# EasyEDA Pro project CyclingAssistance.eprj

# Schematic Schematic1_1
Create Date: 2024-09-04; Page Name: P1; Project Name: CyclingAssistance; Schematic Name: Schematic1_1; Update Date: 2024-09-07; Company: 嘉立创EDA; Page Size: A3; Version: V1.1
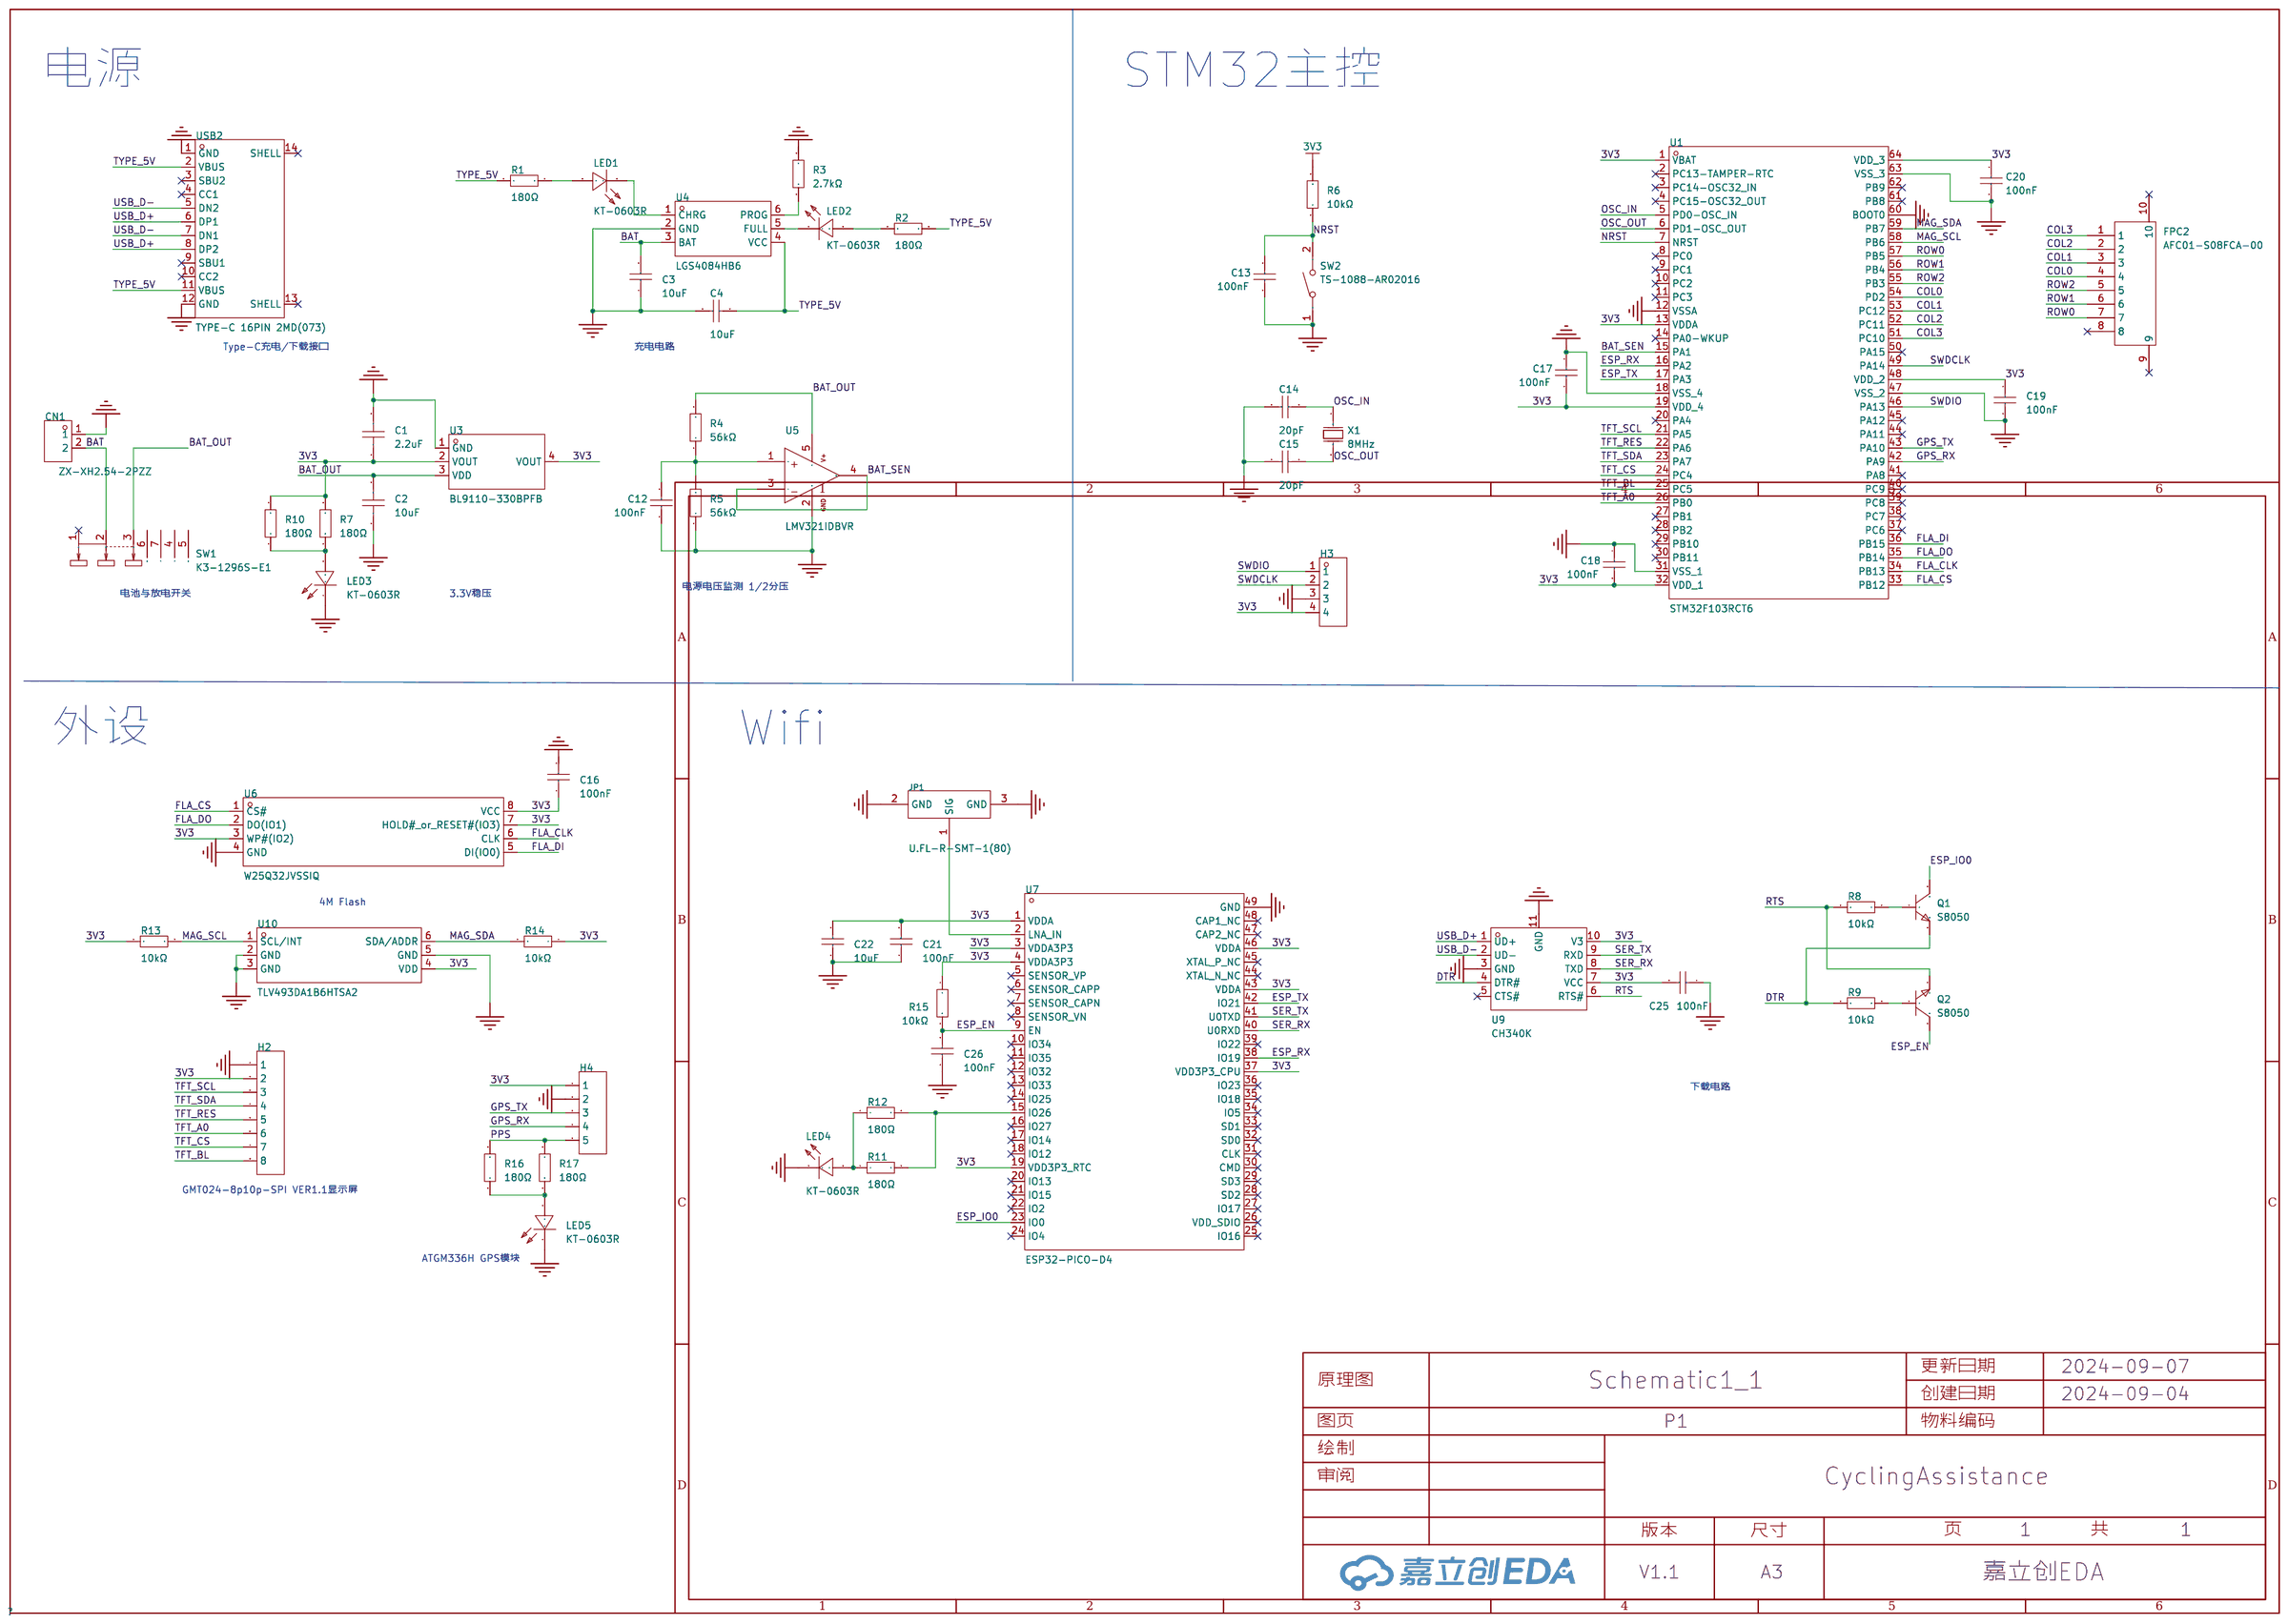
[diagram p0: schematic sheet]

## Parts
C1  2.2uF  [C0402]
C2  10uF  [C0402]
C3  10uF  [C0402]
C4  10uF  [C0402]
C12  100nF  [C0402]
C13  100nF  [C0402]
C14  20pF  [C0402]
C15  20pF  [C0402]
C16  100nF  [C0402]
C17  100nF  [C0402]
C18  100nF  [C0402]
C19  100nF  [C0402]
C20  100nF  [C0402]
C21  100nF  [C0402]
C22  10uF  [C0402]
C25  100nF  [C0402]
C26  100nF  [C0402]
CN1  ZX-XH2.54-2PZZ  [CONN-TH_2P-P2.50_HX25003-2A]
FPC2  AFC01-S08FCA-00  [FPC-SMD_P0.50-8P_FGS-XJ-H2.0]
H2  -  [HDR-TH_8P-P2.54-V-F-1]
H3  -  [HDR-TH_4P-P2.54-V-M]
H4  -  [HDR-TH_5P-P2.54-V-F]
JP1  U.FL-R-SMT-1(80)  [RF-SMD_FRF05002-JSS103M]
LED1  KT-0603R  [LED0603-RD]
LED2  KT-0603R  [LED0603-RD]
LED3  KT-0603R  [LED0603-RD]
LED4  KT-0603R  [LED0603-RD]
LED5  KT-0603R  [LED0603-RD]
Q1  S8050  [SOT-23-3_L2.9-W1.6-P1.90-LS2.8-BR]
Q2  S8050  [SOT-23-3_L2.9-W1.6-P1.90-LS2.8-BR]
R1  180Ω  [R0402]
R2  180Ω  [R0402]
R3  2.7kΩ  [R0402]
R4  56kΩ  [R0402]
R5  56kΩ  [R0402]
R6  10kΩ  [R0603]
R7  180Ω  [R0402]
R8  10kΩ  [R0603]
R9  10kΩ  [R0603]
R10  180Ω  [R0402]
R11  180Ω  [R0402]
R12  180Ω  [R0402]
R13  10kΩ  [R0603]
R14  10kΩ  [R0603]
R15  10kΩ  [R0603]
R16  180Ω  [R0402]
R17  180Ω  [R0402]
SW1  K3-1296S-E1  [SW-TH_K3-1296S-E1]
SW2  TS-1088-AR02016  [SW-SMD_L3.9-W3.0-P4.45]
U1  STM32F103RCT6  [LQFP-64_L10.0-W10.0-P0.50-LS12.0-BL]
U3  BL9110-330BPFB  [SOT-223_L6.5-W3.5-P2.30-LS7.0-BR]
U4  LGS4084HB6  [SOT-23-6_L2.9-W1.6-P0.95-LS2.8-BL]
U5  LMV321IDBVR  [SOT-23-5_L3.0-W1.7-P0.95-LS2.8-BR]
U6  W25Q32JVSSIQ  [SOIC-8_L5.3-W5.3-P1.27-LS8.0-BL]
U7  ESP32-PICO-D4  [ESP32-PICO-D4_lengthen]
U9  CH340K  [ESOP-10_L4.9-W3.9-P1.00-LS6.0-BL-EP]
U10  TLV493DA1B6HTSA2  [SOP-6_L3.0-W1.5-P0.95-LS2.5-BR]
USB2  TYPE-C 16PIN 2MD(073)  [USB-C-SMD_TYPE-C-6PIN-2MD-073]
X1  8MHz  [CRYSTAL-SMD_L11.5-W4.8-LS12.7]

## Library data of the parts
C1 = HGC0402R5225K160NTEJ: 容值:2.2uF;精度:±10%;额定电压:16V;材质(温度系数):X5R;; LCSC Part Name: 2.2uF ±10% 16V; Supplier Part: C7432763; Manufacturer: Chinocera(华瓷); Supplier Footprint: 0402; JLCPCB Part Class: Extended Part; Datasheet: https://atta.szlcsc.com/upload/public/pdf/source/20240320/FAC3FEC40A78BC5CCCE96C232A94D860.pdf; Supplier: LCSC; Tolerance: ±10%; Voltage Rated: 16V; Temperature Coefficient: X5R
C2 = CGA0402X5R106M100GT: 容值:10uF;精度:±20%;额定电压:10V;材质(温度系数):X5R;; LCSC Part Name: 10uF ±20% 10V; Supplier Part: C6119763; Manufacturer: HRE(芯声); Supplier Footprint: 0402; JLCPCB Part Class: Extended Part; Supplier: LCSC; Tolerance: ±20%; Voltage Rated: 10V; Temperature Coefficient: X5R
C3 C4 C22 = CL05A106MQ5NUNC: 容值:10uF;精度:±20%;额定电压:6.3V;材质(温度系数):X5R;; LCSC Part Name: 10uF ±20% 6.3V; Supplier Part: C15525; Manufacturer: SAMSUNG(三星); Supplier Footprint: 0402; JLCPCB Part Class: Basic Part; Datasheet: https://atta.szlcsc.com/upload/public/pdf/source/20220823/2B02EE04F8F211D38A52DCB16EB6BEBA.pdf; Supplier: LCSC; Tolerance: ±20%; Voltage Rated: 6.3V; Temperature Coefficient: X5R
C12 C13 C16-C21 C25 C26 = CL05B104KO5NNNC: 容值:100nF;精度:±10%;额定电压:16V;材质(温度系数):X7R;; LCSC Part Name: 100nF ±10% 16V; Supplier Part: C1525; Manufacturer: SAMSUNG(三星); Supplier Footprint: 0402; JLCPCB Part Class: Basic Part; Datasheet: https://atta.szlcsc.com/upload/public/pdf/source/20160218/1457707763339.pdf; Supplier: LCSC; Tolerance: ±10%; Voltage Rated: 16V; Temperature Coefficient: X7R
C14 C15 = 0402CG200J500NT: 容值:20pF;精度:±5%;额定电压:50V;材质(温度系数):C0G;; LCSC Part Name: 20pF ±5% 50V; Supplier Part: C1554; Manufacturer: FH(风华); Supplier Footprint: 0402; JLCPCB Part Class: Basic Part; Datasheet: https://atta.szlcsc.com/upload/public/pdf/source/20200305/C486355_26A10D38EF8C2A5C37091D0039909270.pdf; Supplier: LCSC; Tolerance: ±5%; Voltage Rated: 50V; Temperature Coefficient: C0G
CN1 = ZX-XH2.54-2PZZ: 插针结构:1x2P;间距:2.54mm;安装方式:直插;参考系列:XH;总PIN数:2P;排数:1;每排PIN数:2;行距:-;额定电流:3A;触头材质:黄铜;触头镀层:锡;工作温度范围:-25℃~+85℃;; Supplier Part: C7429632; Manufacturer: Megastar(兆星); Supplier Footprint: 插件,P=2.54mm; JLCPCB Part Class: Extended Part; Datasheet: https://atta.szlcsc.com/upload/public/pdf/source/20230619/19BA6947230AA44A04D3EDD65E618FD0.pdf; Supplier: LCSC; Pins Structure: 1x2P; Pitch: 2.54mm; Mounting Style: 直插; Reference Series: XH; Number of Pins: 2P; Number of Rows: 1; Number of PINs Per Row: 2; Current Rating (Max): 3A; Contact Material: 黄铜; Contact Plating: 锡; Operating Temperature Range: -25℃~+85℃
FPC2 = AFC01-S08FCA-00: 锁定特性:翻盖式;触点类型:下接;触点数量:8P;间距:0.5mm;安装类型:卧贴;; LCSC Part Name: 间距:0.5mm P数:8P 翻盖式 下接; Supplier Part: C262657; Manufacturer: JS(钜硕电子); Supplier Footprint: SMD,P=0.5mm,卧贴; JLCPCB Part Class: Extended Part; Datasheet: https://atta.szlcsc.com/upload/public/pdf/source/20190816/C413942_2A72D1AC756EAE17EEDF756A339D4500.pdf; Supplier: LCSC; Locking Feature: 翻盖式; Contact Type: 下接; Number of Contacts: 8P; Pitch: 0.5mm; Mounting Type: 卧贴; FFC, FCB Thickness: 0.3mm; Height Above Board: 2mm
H2 = HDR-F_2.54_1x8P: Supplier Part: C27438; Supplier Footprint: 插件
H3 = HDR-M_2.54_1x4P: Supplier Part: C492403; Supplier Footprint: 插件
H4 = HDR-F_2.54_1x5P: Supplier Part: C50950; Supplier Footprint: 插件
JP1 = U.FL-R-SMT-1(80)_C88374: 连接器类型:板端;接口类型:内针;端口数量:1;接口直径:2mm;接口长度/高度:1.25mm;频率-最大值:6GHz;射频系列:IPEX;阻抗:50Ω;样式:-;触头材质:黄铜;工作温度范围:-40℃~+90℃;; LCSC Part Name: IPEX 内针; Supplier Part: C88374; Manufacturer: HRS(广濑); Supplier Footprint: SMD; JLCPCB Part Class: Extended Part; Datasheet: https://atta.szlcsc.com/upload/public/pdf/source/20161125/1480067868647.pdf; Supplier: LCSC; Connector Type: 板端; Interface Type: 内针; Number of Ports: 1; Interface Diameter: 2mm; Interface Length/Height: 1.25mm; Frequency-Max: 6GHz; RF Series: IPEX; Impedance: 50Ω; Contact Material: 黄铜; Operating Temperature Range: -40℃~+90℃
LED1-LED5 = KT-0603R: 发光颜色:红色;功率:-;正向电流:-;主波长:-;二极管配置:-;透镜颜色:-;色温:-;发光角度:-;载带方式:-;工作温度:-40℃~+85℃;; LCSC Part Name: 0603 红灯 高亮; Supplier Part: C2286; Manufacturer: KENTO; Supplier Footprint: 0603; JLCPCB Part Class: Basic Part; Datasheet: https://atta.szlcsc.com/upload/public/pdf/source/20160616/1466072038404.pdf; Supplier: LCSC; Emitted Color: 红色; Operating Temperature: -40℃~+85℃
Q1 Q2 = S8050_C181158: 晶体管类型:NPN;集电极电流(Ic):500mA;集射极击穿电压(Vceo):25V;功率(Pd):300mW;; LCSC Part Name: NPN 电流:500mA 耐压:25V; Supplier Part: C181158; Manufacturer: Hottech(合科泰); Supplier Footprint: SOT-23; JLCPCB Part Class: Extended Part; Datasheet: https://atta.szlcsc.com/upload/public/pdf/source/20220506/D987F39D56F2975D34EC7947E75C4ABC.pdf; Supplier: LCSC; Transistor Type: NPN; Collector Current (Ic): 500mA; Collector-Emitter Breakdown Voltage (Vceo): 25V; Power Dissipation (Pd): 300mW; Transition Frequency (fT): 150MHz; Collector Cut-Off Current (Icbo): 100nA; Collector-Emitter Saturation Voltage (VCE(sat)@Ic,Ib): 600mV@500mA,50mA
R1 R2 R7 R10-R12 R16 R17 = 0402WGF1800TCE: 电阻类型:厚膜电阻;阻值:180Ω;精度:±1%;功率:62.5mW;最大工作电压:50V;温度系数:±100ppm/℃;; LCSC Part Name: 180Ω ±1% 62.5mW 厚膜电阻; Supplier Part: C38941; Manufacturer: UNI-ROYAL(厚声); Supplier Footprint: 0402; JLCPCB Part Class: Extended Part; Datasheet: https://atta.szlcsc.com/upload/public/pdf/source/20200306/C422600_1E6D84923E4A46A82E41ADD87F860B5C.pdf; Supplier: LCSC; Type: 厚膜电阻; Tolerance: ±1%; Power(Watts): 62.5mW; Overload Voltage (Max): 50V; Temperature Coefficient: ±100ppm/℃; Operating Temperature Range: -55℃~+155℃
R3 = 0402WGF2701TCE: 电阻类型:厚膜电阻;阻值:2.7kΩ;精度:±1%;功率:62.5mW;最大工作电压:50V;温度系数:±100ppm/℃;; LCSC Part Name: 2.7kΩ ±1% 62.5mW 厚膜电阻; Supplier Part: C25885; Manufacturer: UNI-ROYAL(厚声); Supplier Footprint: 0402; JLCPCB Part Class: Extended Part; Datasheet: https://atta.szlcsc.com/upload/public/pdf/source/20200306/C422600_1E6D84923E4A46A82E41ADD87F860B5C.pdf; Supplier: LCSC; Type: 厚膜电阻; Tolerance: ±1%; Power(Watts): 62.5mW; Overload Voltage (Max): 50V; Temperature Coefficient: ±100ppm/℃; Operating Temperature Range: -55℃~+155℃
R4 R5 = RC0402FR-0756KL: 电阻类型:厚膜电阻;阻值:56kΩ;精度:±1%;功率:62.5mW;最大工作电压:50V;温度系数:±100ppm/℃;; LCSC Part Name: 厚膜电阻 56kΩ ±1% 62.5mW; Supplier Part: C114756; Manufacturer: YAGEO(国巨); Supplier Footprint: 0402; JLCPCB Part Class: Extended Part; Datasheet: https://atta.szlcsc.com/upload/public/pdf/source/20180821/C275644_0D56F95EFF785E7D9A1FEF436B37DA78.pdf; Supplier: LCSC; Type: 厚膜电阻; Tolerance: ±1%; Power(Watts): 62.5mW; Overload Voltage (Max): 50V; Temperature Coefficient: ±100ppm/℃; Operating Temperature Range: -55℃~+155℃
R6 R8 R9 R13-R15 = 0603WAF1002T5E: 电阻类型:厚膜电阻;阻值:10kΩ;精度:±1%;功率:100mW;最大工作电压:75V;温度系数:±100ppm/℃;; LCSC Part Name: 厚膜电阻 10kΩ ±1% 100mW; Supplier Part: C25804; Manufacturer: UNI-ROYAL(厚声); Supplier Footprint: 0603; JLCPCB Part Class: Basic Part; Datasheet: https://atta.szlcsc.com/upload/public/pdf/source/20200306/C422600_1E6D84923E4A46A82E41ADD87F860B5C.pdf; Supplier: LCSC; Type: 厚膜电阻; Tolerance: ±1%; Power(Watts): 100mW; Overload Voltage (Max): 75V; Temperature Coefficient: ±100ppm/℃; Operating Temperature Range: -55℃~+155℃
SW1 = K3-1296S-E1: 电路结构:单刀双掷;安装方式:卧贴;开关颜色:黑色;额定电流(DC):300mA;额定电压(DC):4V;额定电流(AC):-;额定电压(AC):-;机械寿命:1万次;; LCSC Part Name: 卧贴双档 滑动开关; Supplier Part: C128955; Manufacturer: 韩国韩荣; Supplier Footprint: SMD; JLCPCB Part Class: Extended Part; Datasheet: https://atta.szlcsc.com/upload/public/pdf/source/20210810/891A308926761427C641228111E8C4D0.pdf; Supplier: LCSC; Circuit: 单刀双掷; Actuator Style: 矩形柱状; Pin Style: SMD接片; Switch Length: 6.6mm; Switch Width: 2.7mm; Switch Height: 1.4mm; Mounting Style: 卧贴; Actuator Color: 黑色; Current Rating (DC): 300mA; Voltage Rating (DC): 4V; Mechanical Life: 1万次; Operating Temperature: -25℃~+80℃
SW2 = TS-1088-AR02016: 电路结构:单刀单掷;按钮形状:圆形按钮;作用力:160gf;安装方式:立贴;开关长度:4mm;开关宽度:3mm;开关高度:2mm;带支架:不带;触点电流:50mA;额定电压(DC):12V;绝缘电阻:100MΩ;机械寿命:10万次;; LCSC Part Name: 4*3*2mm 立贴 轻触开关; Supplier Part: C720477; Manufacturer: XUNPU(讯普); Supplier Footprint: SMD; JLCPCB Part Class: Extended Part; Datasheet: https://atta.szlcsc.com/upload/public/pdf/source/20200810/C720475_60D09DD6C54279ADDB2DC25100F1CC11.pdf; Supplier: LCSC; Circuit: 单刀单掷; Actuator Style: 圆形按钮; Operating Force: 160gf; Mounting Style: 立贴; Switch Length: 4mm; Switch Width: 3mm; Switch Height: 2mm; Strike Gundam: 不带; Contact Current: 50mA; Voltage Rating (DC): 12V; Insulation Resistance: 100MΩ; Actuator/Cap Color: 黑色; Pin Style: SMD接片; Mechanical Life: 10万次; Operating Temperature: -30℃~+80℃
U1 = STM32F103RCT6: CPU内核:ARM-M3;程序存储容量:256KB;RAM总容量:48KB;GPIO端口数量:51;工作电压范围:2V~3.6V;CPU最大主频:72MHz;程序存储器类型:FLASH;; LCSC Part Name: 主流增强型ARM Cortex-M3 MCU，具有256 KB Flash、72 MHz CPU、电机控制、USB和CAN; Supplier Part: C8323; Manufacturer: ST(意法半导体); Supplier Footprint: LQFP-64(10x10); JLCPCB Part Class: Extended Part; Datasheet: https://atta.szlcsc.com/upload/public/pdf/source/20180207/C88442_15179953708671359491.pdf; Supplier: LCSC; CPU Core: ARM-M3; Program Storage Size: 256KB; RAM Size: 48KB; GPIO Ports Number: 51; Operating Voltage Range: 2V~3.6V; CPU Maximum Speed: 72MHz; Program Memory Type: FLASH; Operating Temperature Range: -40℃~+85℃; ADC (Bit): 12bit; DAC (Bit): 12bit; Universal Serial Bus: 有; Peripheral/Function: DMA；温度传感器；PWM; Watchdog: 有; Infrared Data Association: 有; Low-Voltage Detect: 有; Direct Memory Access: 有; Internal Oscillator: 有
U3 = BL9110-330BPFB: 输出类型:固定;最大输入电压:6V;输出电压:3.3V;最大输出电流:1A;电源纹波抑制比(PSRR):70dB@(1kHz);输出极性:正极;; LCSC Part Name: 输入6V 输出3.3V 1A; Supplier Part: C169246; Manufacturer: BL(上海贝岭); Supplier Footprint: SOT-223; JLCPCB Part Class: Extended Part; Datasheet: https://atta.szlcsc.com/upload/public/pdf/source/20180705/C248270_2CFF879E361E2024221F82A6F237DEBB.pdf; Supplier: LCSC; Output Type: 固定; Maximum Input Voltage: 6V; Output Voltage: 3.3V; MAX Output Current: 1A; Power Supply Rejection Ratio (PSRR): 70dB@(1kHz); Dropout Voltage: 390mV@(1A); Output Polarity: 正极; Number of Outputs: 1
U4 = LGS4084HB6: 电源电压:4V~6V;最大充电电流:500mA;电池类型:锂离子/聚合物;电池节数:1;; LCSC Part Name: 单节锂电池充电 高压4054(SOT23-6); Supplier Part: C5299901; Manufacturer: Legend-Si(棱晶半导体); Supplier Footprint: SOT-23-6; JLCPCB Part Class: Extended Part; Datasheet: https://atta.szlcsc.com/upload/public/pdf/source/20230407/94D9C0552C6EF587CC76B9FFE17BDA56.pdf; Supplier: LCSC; The Chip Type: 线性充电芯片; Supply Voltage: 4V~6V; Maximum Charge Current: 500mA; Charging Saturation Voltage: 4.2V; Type of Battery: 锂离子/聚合物; Number of Cells: 1; Operating Temperature: -40℃~+125℃
U5 = LMV321IDBVR_C7972: 放大器数:单路;增益带宽积(GBP):1MHz;输入偏置电流(Ib):15nA;压摆率(SR):1V/us;带宽(-3db):-;轨到轨:-;; Supplier Part: C7972; Manufacturer: TI(德州仪器); Supplier Footprint: SOT-23-5; JLCPCB Part Class: Extended Part; Datasheet: https://www.ti.com/cn/lit/gpn/lmv321; Supplier: LCSC; Number of Circuits: 单路; Gain Bandwidth Product(GBP): 1MHz; Current - Input Bias(Ib): 15nA; Slew Rate(SR): 1V/us; Output Current: 160mA; Supply Current: 130uA; Operating Temperature: -40℃~+125℃
U6 = W25Q32JVSSIQ: Supplier Part: C179173; Manufacturer: WINBOND(华邦); Supplier Footprint: SOIC-8-208mil; JLCPCB Part Class: Extended Part; Datasheet: https://atta.szlcsc.com/upload/public/pdf/source/20191218/C179173_5BBD793D2D7B3672E140BC7AE85C11FF.pdf; Supplier: LCSC
U7 = ESP32-PICO-D4: 频率范围:2.4GHz~2.5GHz;接口:ADC, SDIO, SPI, PWM, UART, I2C, I2S, GPIO;应用领域:蓝牙,WiFi;数据速率:-;灵敏度:-;典型应用频率:-;; LCSC Part Name: 集成2.4GHz WIFI和蓝牙的模组; Supplier Part: C193707; Manufacturer: ESPRESSIF(乐鑫); Supplier Footprint: QFN-48-EP(7x7); JLCPCB Part Class: Extended Part; Datasheet: https://atta.szlcsc.com/upload/public/pdf/source/20180531/C193707_20E6BADDB6EC95F0C0D505BA515D2866.pdf; Supplier: LCSC; Frequency Range: 2.4GHz~2.5GHz; Interface: ADC, SDIO, SPI, PWM, UART, I2C, I2S, GPIO; Operating Voltage: 2.7V~3.6V; Applications: 蓝牙,WiFi; Operating Temperature: -40℃~+85℃
U9 = CH340K_C18208922: LCSC Part Name: CH340K 人工转编带; Supplier Part: C18208922; Manufacturer: WCH(南京沁恒); Supplier Footprint: ESSOP-10-150mil-1mm; JLCPCB Part Class: Extended Part; Datasheet: https://atta.szlcsc.com/upload/public/pdf/source/20240313/9D833A30DDFD16C064A7ADE10A944019.pdf; Supplier: LCSC
U10 = TLV493DA1B6HTSA2: 3D磁性传感器; LCSC Part Name: 磁场传感器; Supplier Part: C126688; Manufacturer: Infineon(英飞凌); Supplier Footprint: SOP-6-1.5mm; JLCPCB Part Class: Extended Part; Datasheet: https://atta.szlcsc.com/upload/public/pdf/source/20170818/C126688_1503051290851895354.pdf; Supplier: LCSC
USB2 = TYPE-C 16PIN 2MD(073): 连接器类型:Type-C;标准:-;公母:母;端口数量:1;触点数量:16P;安装方式:卧贴;额定电流 - 电源:5A;工作温度范围:-25℃~+85℃;; LCSC Part Name: Type-C 母 卧贴; Supplier Part: C2765186; Manufacturer: SHOU HAN(首韩); Supplier Footprint: SMD; JLCPCB Part Class: Extended Part; Datasheet: https://atta.szlcsc.com/upload/public/pdf/source/20211123/39B17C16241EAC15C5E277BDA434118E.pdf; Supplier: LCSC; Connector Type: Type-C; Gender: 母; Number of Ports: 1; Number of Contacts: 16P; Mounting Style: 卧贴; Current Rating - Power (Max): 5A; Operating Temperature Range: -25℃~+85℃
X1 = X49SM8MSD2SC: 晶振类型:贴片晶振;频率:8MHz;常温频差:±20ppm;外接负载电容:20pF;频率稳定度(全温):±30ppm;; LCSC Part Name: 8MHz ±20ppm 20pF; Supplier Part: C12674; Manufacturer: YXC(扬兴晶振); Supplier Footprint: HC-49S-SMD; JLCPCB Part Class: Basic Part; Datasheet: https://atta.szlcsc.com/upload/public/pdf/source/20240329/3EBF42EBCAB50CA65B6FA9D7CFA1955A.pdf; Supplier: LCSC; Crystal Type: 贴片晶振; Normal temperature Frequency Tolerance: ±20ppm; External load capacitor: 20pF; Frequency Stability(Full temperature range): ±30ppm; Operating Temperature: -20℃~+70℃

## Nets
3V3: C1.1 C16.1 C17.2 C18.2 C19.1 C20.1 C21.2 C22.2 C25.2 H2.2 H3.4 H4.1 R6.2 R7.2 R10.2 R13.1 R14.1 R15.1 U1.1(VBAT) U1.13(VDDA) U1.19(VDD_4) U1.32(VDD_1) U1.48(VDD_2) U1.64(VDD_3) U3.2(VOUT) U3.4(VOUT) U6.3(WP#(IO2)) U6.7(HOLD# or RESET#(IO3)) U6.8(VCC) U7.1(VDDA) U7.3(VDDA3P3) U7.4(VDDA3P3) U7.19(VDD3P3_RTC) U7.37(VDD3P3_CPU) U7.43(VDDA) U7.46(VDDA) U9.7(VCC) U9.10(V3) U10.4(VDD)
GND: C1.2 C2.1 C3.1 C4.1 C12.2 C13.2 C14.1 C15.1 C16.2 C17.1 C18.1 C19.2 C20.2 C21.1 C22.1 C25.1 C26.1 CN1.1 H2.1 H3.3 H4.2 JP1.2(GND) JP1.3(GND) LED3.1(K) LED4.1(K) LED5.1(K) R3.2 R5.1 SW2.1 U1.12(VSSA) U1.18(VSS_4) U1.31(VSS_1) U1.47(VSS_2) U1.60(BOOT0) U1.63(VSS_3) U3.1(GND) U4.2(GND) U5.2(GND) U6.4(GND) U7.49(GND) U9.3(GND) U9.11(GND) U10.2(GND) U10.3(GND) U10.5(GND) USB2.1(GND) USB2.12(GND)
BAT: C3.2 CN1.2 SW1.2 U4.3(BAT)
BAT_OUT: C2.2 R4.2 SW1.3 U3.3(VDD) U5.5(V+)
BAT_SEN: U1.15(PA1) U5.3(-) U5.4(OUT)
COL0: FPC2.4 U1.54(PD2)
COL1: FPC2.3 U1.53(PC12)
COL2: FPC2.2 U1.52(PC11)
COL3: FPC2.1 U1.51(PC10)
DTR: Q1.2 R9.1 U9.4(DTR#)
ESP_EN: C26.2 Q2.3 R15.2 U7.9(EN)
ESP_IO0: Q1.3 U7.23(IO0)
ESP_RX: U1.16(PA2) U7.38(IO19)
ESP_TX: U1.17(PA3) U7.42(IO21)
FLA_CLK: U1.34(PB13) U6.6(CLK)
FLA_CS: U1.33(PB12) U6.1(CS#)
FLA_DI: U1.36(PB15) U6.5(DI(IO0))
FLA_DO: U1.35(PB14) U6.2(DO(IO1))
GPS_RX: H4.4 U1.42(PA9)
GPS_TX: H4.3 U1.43(PA10)
MAG_SCL: R13.2 U1.58(PB6) U10.1(SCL/INT)
MAG_SDA: R14.2 U1.59(PB7) U10.6(SDA/ADDR)
NRST: C13.1 R6.1 SW2.2 U1.7(NRST)
OSC_IN: C14.2 U1.5(PD0-OSC_IN) X1.1(OSC1)
OSC_OUT: C15.2 U1.6(PD1-OSC_OUT) X1.2(OSC2)
PPS: H4.5 R16.2 R17.2
ROW0: FPC2.7 U1.57(PB5)
ROW1: FPC2.6 U1.56(PB4)
ROW2: FPC2.5 U1.55(PB3)
RTS: Q2.2 R8.2 U9.6(RTS#)
SER_RX: U7.40(U0RXD) U9.8(TXD)
SER_TX: U7.41(U0TXD) U9.9(RXD)
SWDCLK: H3.2 U1.49(PA14)
SWDIO: H3.1 U1.46(PA13)
TFT_A0: H2.6 U1.26(PB0)
TFT_BL: H2.8 U1.25(PC5)
TFT_CS: H2.7 U1.24(PC4)
TFT_RES: H2.5 U1.22(PA6)
TFT_SCL: H2.3 U1.21(PA5)
TFT_SDA: H2.4 U1.23(PA7)
TYPE_5V: C4.2 R1.1 R2.2 U4.4(VCC) USB2.2(VBUS) USB2.11(VBUS)
USB_D+: U9.1(UD+) USB2.6(DP1) USB2.8(DP2)
USB_D-: U9.2(UD-) USB2.5(DN2) USB2.7(DN1)
$1N1886: R3.1 U4.6(PROG)
$1N2415: C12.1 R4.1 R5.2 U5.1(+)
$1N24529: JP1.1(SIG) U7.2(LNA_IN)
$1N36211: R11.2 R12.2 U7.15(IO26)
$1N38447: Q2.1 R9.2
$1N38448: Q1.1 R8.1
Net-(LED1-1): LED1.1(K) U4.1(CHRG)
Net-(LED1-2): LED1.2(A) R1.2
Net-(LED2-1): LED2.1(K) U4.5(FULL)
Net-(LED2-2): LED2.2(A) R2.1
Net-(LED3-2): LED3.2(A) R7.1 R10.1
Net-(LED4-2): LED4.2(A) R11.1 R12.1
Net-(LED5-2): LED5.2(A) R16.1 R17.1

Not connected (* = marked no-connect by the designer): FPC2 8* 9* 10*; SW1 1* 4 5 6 7; U1 2(PC13-TAMPER-RTC)* 3(PC14-OSC32_IN)* 4(PC15-OSC32_OUT)* 8(PC0)* 9(PC1)* 10(PC2)* 11(PC3)* 14(PA0-WKUP)* 20(PA4)* 27(PB1)* 28(PB2)* 29(PB10)* 30(PB11)* 37(PC6)* 38(PC7)* 39(PC8)* 40(PC9)* 41(PA8)* 44(PA11)* 45(PA12)* 50(PA15)* 61(PB8)* 62(PB9)*; U7 5(SENSOR_VP)* 6(SENSOR_CAPP)* 7(SENSOR_CAPN)* 8(SENSOR_VN)* 10(IO34)* 11(IO35)* 12(IO32)* 13(IO33)* 14(IO25)* 16(IO27)* 17(IO14)* 18(IO12)* 20(IO13)* 21(IO15)* 22(IO2)* 24(IO4)* 25(IO16)* 26(VDD_SDIO)* 27(IO17)* 28(SD2)* 29(SD3)* 30(CMD)* 31(CLK)* 32(SD0)* 33(SD1)* 34(IO5)* 35(IO18)* 36(IO23)* 39(IO22)* 44(XTAL_N_NC)* 45(XTAL_P_NC)* 47(CAP2_NC)* 48(CAP1_NC)*; U9 5(CTS#)*; USB2 3(SBU2)* 4(CC1)* 9(SBU1)* 10(CC2)* 13(SHELL)* 14(SHELL)*

## Notes on the sheet
- 电源
- STM32主控
- Type-C充电/下载接口
- 充电电路
- 电池与放电开关
- 3.3V稳压
- 电源电压监测 1/2分压
- 外设
- Wifi
- 4M Flash
- 下载电路
- GMT024-8p10p-SPI VER1.1显示屏
- ATGM336H GPS模块

# Schematic Schematic2
Create Date: 2024-09-06; Page Name: P1; Project Name: CyclingAssistance; Schematic Name: Schematic2; Update Date: 2024-09-06; Company: 嘉立创EDA; Page Size: A4; Version: V1.0
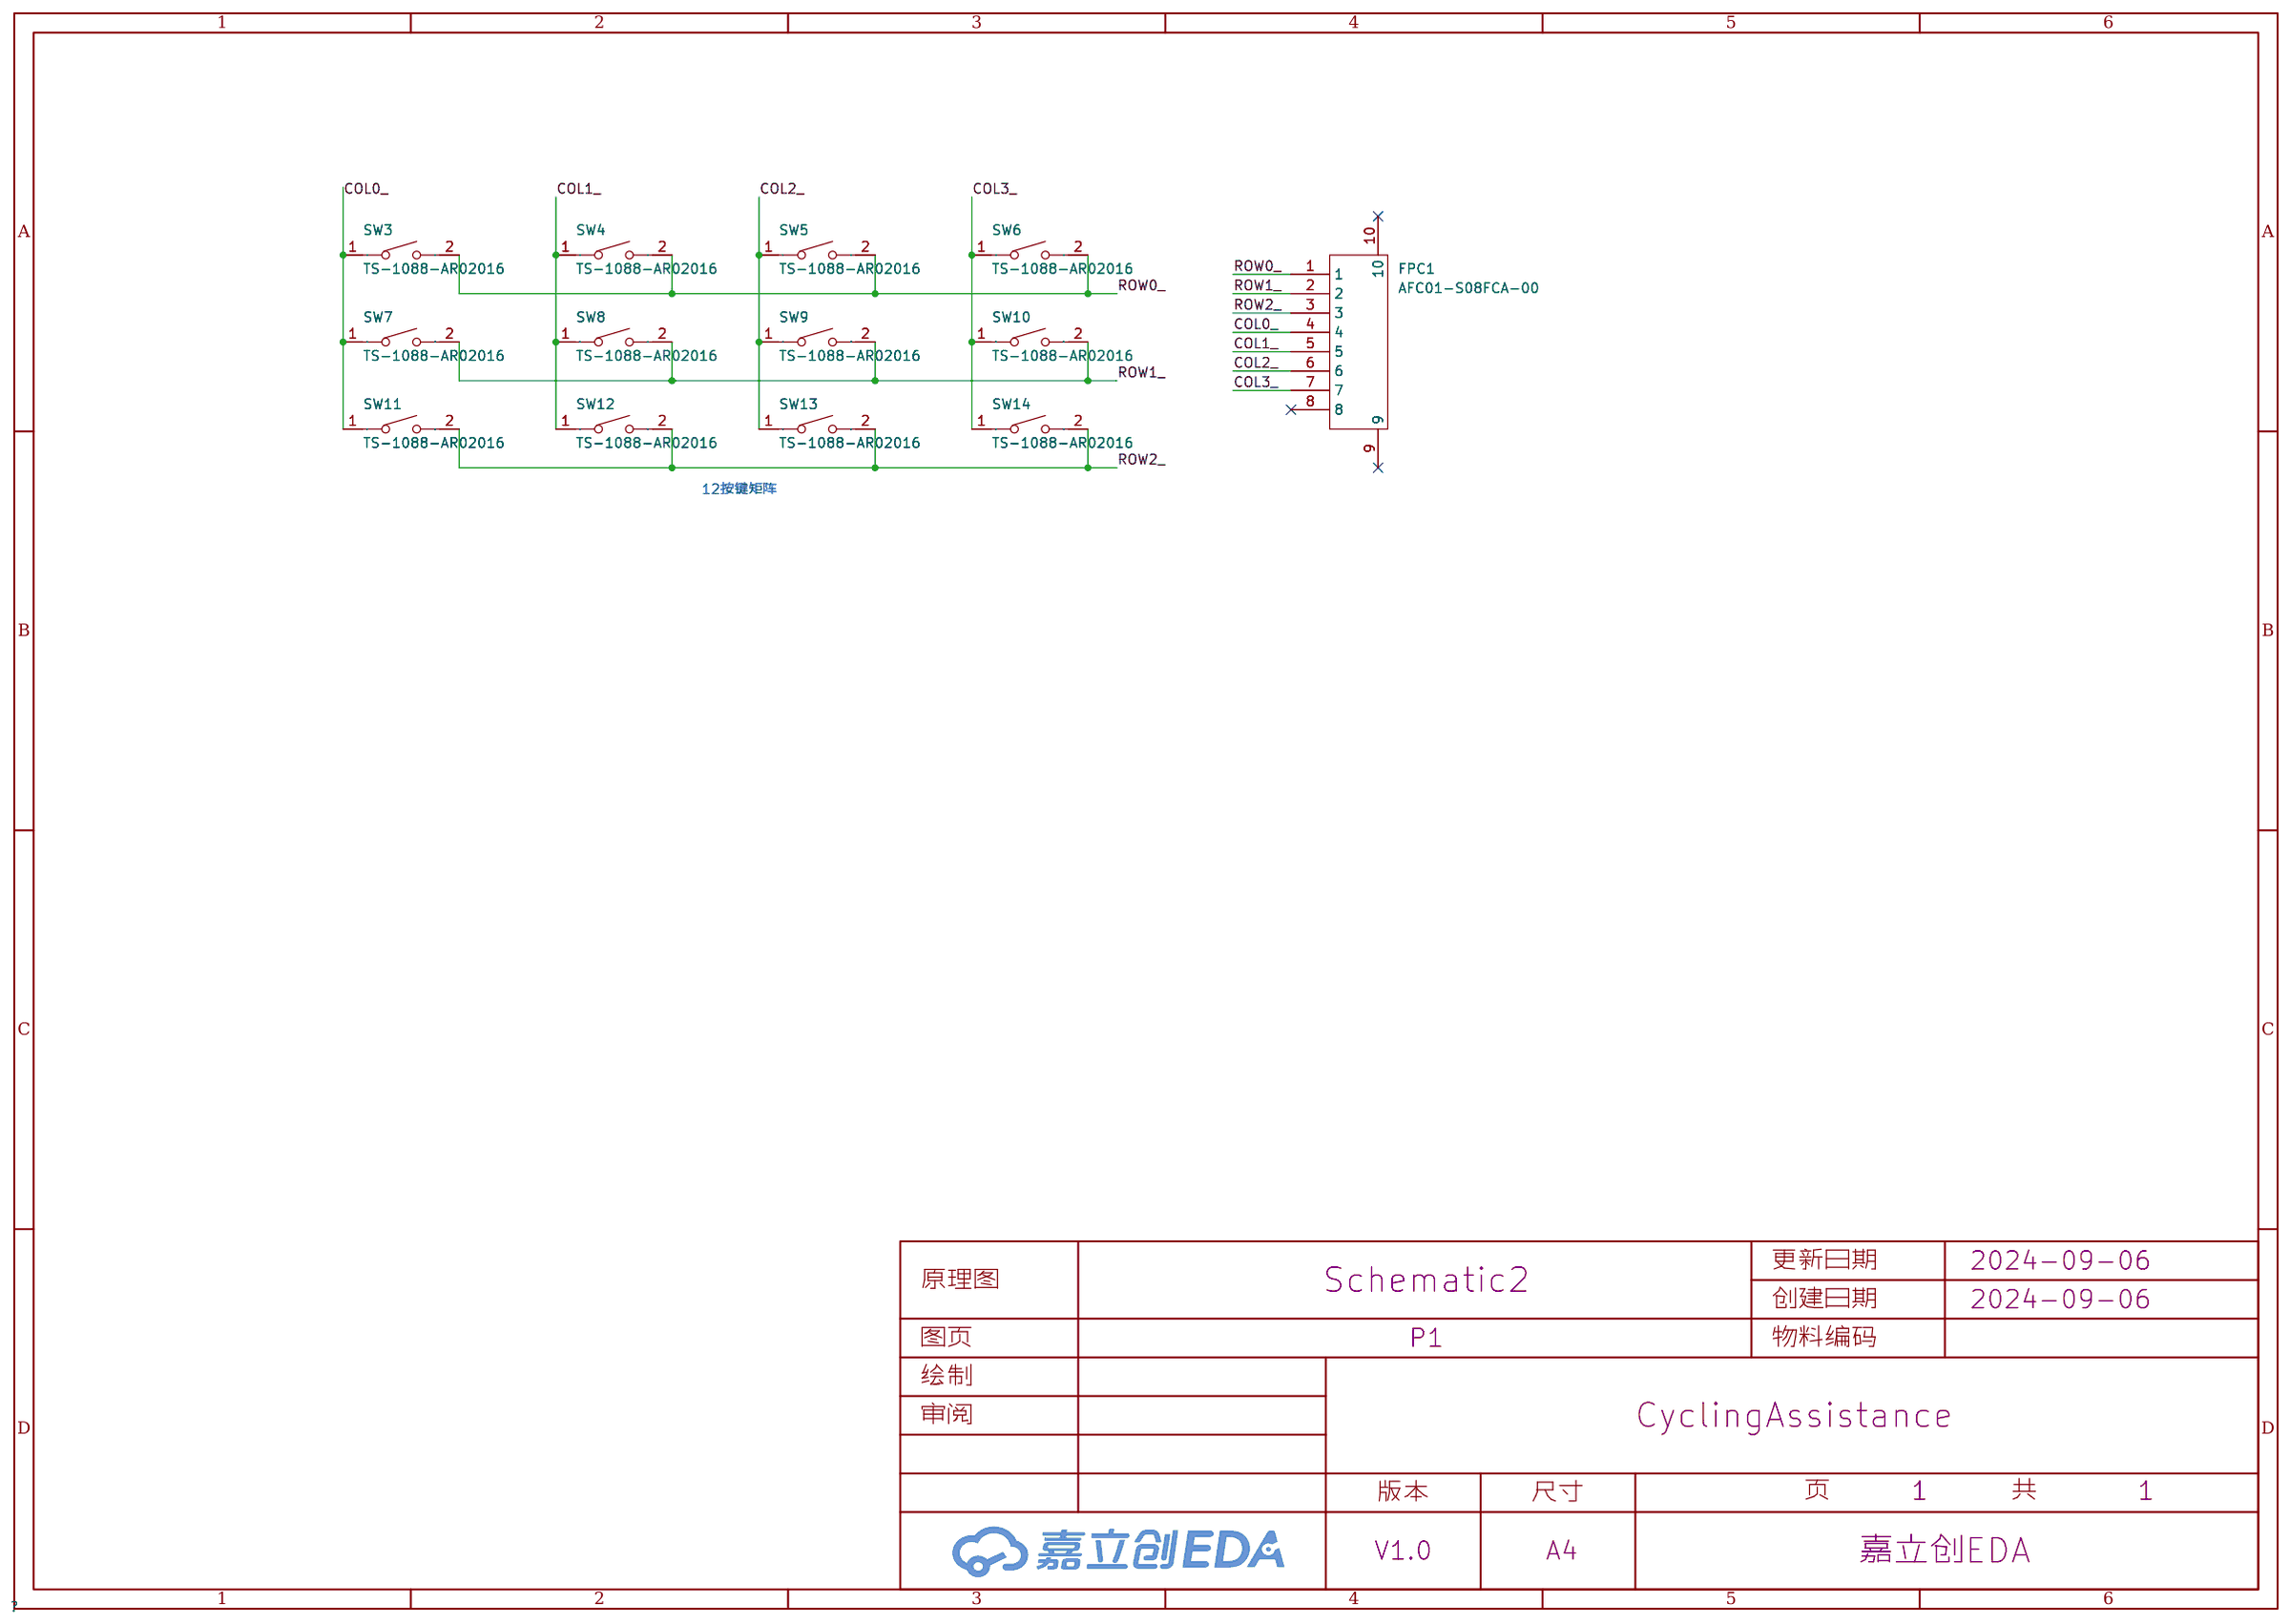
[diagram p1: schematic sheet]

## Parts
FPC1  AFC01-S08FCA-00  [FPC-SMD_P0.50-8P_FGS-XJ-H2.0]
SW3  TS-1088-AR02016  [SW-SMD_L3.9-W3.0-P4.45]
SW4  TS-1088-AR02016  [SW-SMD_L3.9-W3.0-P4.45]
SW5  TS-1088-AR02016  [SW-SMD_L3.9-W3.0-P4.45]
SW6  TS-1088-AR02016  [SW-SMD_L3.9-W3.0-P4.45]
SW7  TS-1088-AR02016  [SW-SMD_L3.9-W3.0-P4.45]
SW8  TS-1088-AR02016  [SW-SMD_L3.9-W3.0-P4.45]
SW9  TS-1088-AR02016  [SW-SMD_L3.9-W3.0-P4.45]
SW10  TS-1088-AR02016  [SW-SMD_L3.9-W3.0-P4.45]
SW11  TS-1088-AR02016  [SW-SMD_L3.9-W3.0-P4.45]
SW12  TS-1088-AR02016  [SW-SMD_L3.9-W3.0-P4.45]
SW13  TS-1088-AR02016  [SW-SMD_L3.9-W3.0-P4.45]
SW14  TS-1088-AR02016  [SW-SMD_L3.9-W3.0-P4.45]

## Library data of the parts
FPC1 = AFC01-S08FCA-00: 锁定特性:翻盖式;触点类型:下接;触点数量:8P;间距:0.5mm;安装类型:卧贴;; LCSC Part Name: 间距:0.5mm P数:8P 翻盖式 下接; Supplier Part: C262657; Manufacturer: JS(钜硕电子); Supplier Footprint: SMD,P=0.5mm,卧贴; JLCPCB Part Class: Extended Part; Datasheet: https://atta.szlcsc.com/upload/public/pdf/source/20190816/C413942_2A72D1AC756EAE17EEDF756A339D4500.pdf; Supplier: LCSC; Locking Feature: 翻盖式; Contact Type: 下接; Number of Contacts: 8P; Pitch: 0.5mm; Mounting Type: 卧贴; FFC, FCB Thickness: 0.3mm; Height Above Board: 2mm
SW3-SW14 = TS-1088-AR02016: 电路结构:单刀单掷;按钮形状:圆形按钮;作用力:160gf;安装方式:立贴;开关长度:4mm;开关宽度:3mm;开关高度:2mm;带支架:不带;触点电流:50mA;额定电压(DC):12V;绝缘电阻:100MΩ;机械寿命:10万次;; LCSC Part Name: 4*3*2mm 立贴 轻触开关; Supplier Part: C720477; Manufacturer: XUNPU(讯普); Supplier Footprint: SMD; JLCPCB Part Class: Extended Part; Datasheet: https://atta.szlcsc.com/upload/public/pdf/source/20200810/C720475_60D09DD6C54279ADDB2DC25100F1CC11.pdf; Supplier: LCSC; Circuit: 单刀单掷; Actuator Style: 圆形按钮; Operating Force: 160gf; Mounting Style: 立贴; Switch Length: 4mm; Switch Width: 3mm; Switch Height: 2mm; Strike Gundam: 不带; Contact Current: 50mA; Voltage Rating (DC): 12V; Insulation Resistance: 100MΩ; Actuator/Cap Color: 黑色; Pin Style: SMD接片; Mechanical Life: 10万次; Operating Temperature: -30℃~+80℃

## Nets
COL0_: FPC1.4 SW3.1 SW7.1 SW11.1
COL1_: FPC1.5 SW4.1 SW8.1 SW12.1
COL2_: FPC1.6 SW5.1 SW9.1 SW13.1
COL3_: FPC1.7 SW6.1 SW10.1 SW14.1
ROW0_: FPC1.1 SW3.2 SW4.2 SW5.2 SW6.2
ROW1_: FPC1.2 SW7.2 SW8.2 SW9.2 SW10.2
ROW2_: FPC1.3 SW11.2 SW12.2 SW13.2 SW14.2

Not connected (* = marked no-connect by the designer): FPC1 8* 9* 10*

## Notes on the sheet
- 12按键矩阵

# Board PCB1_1
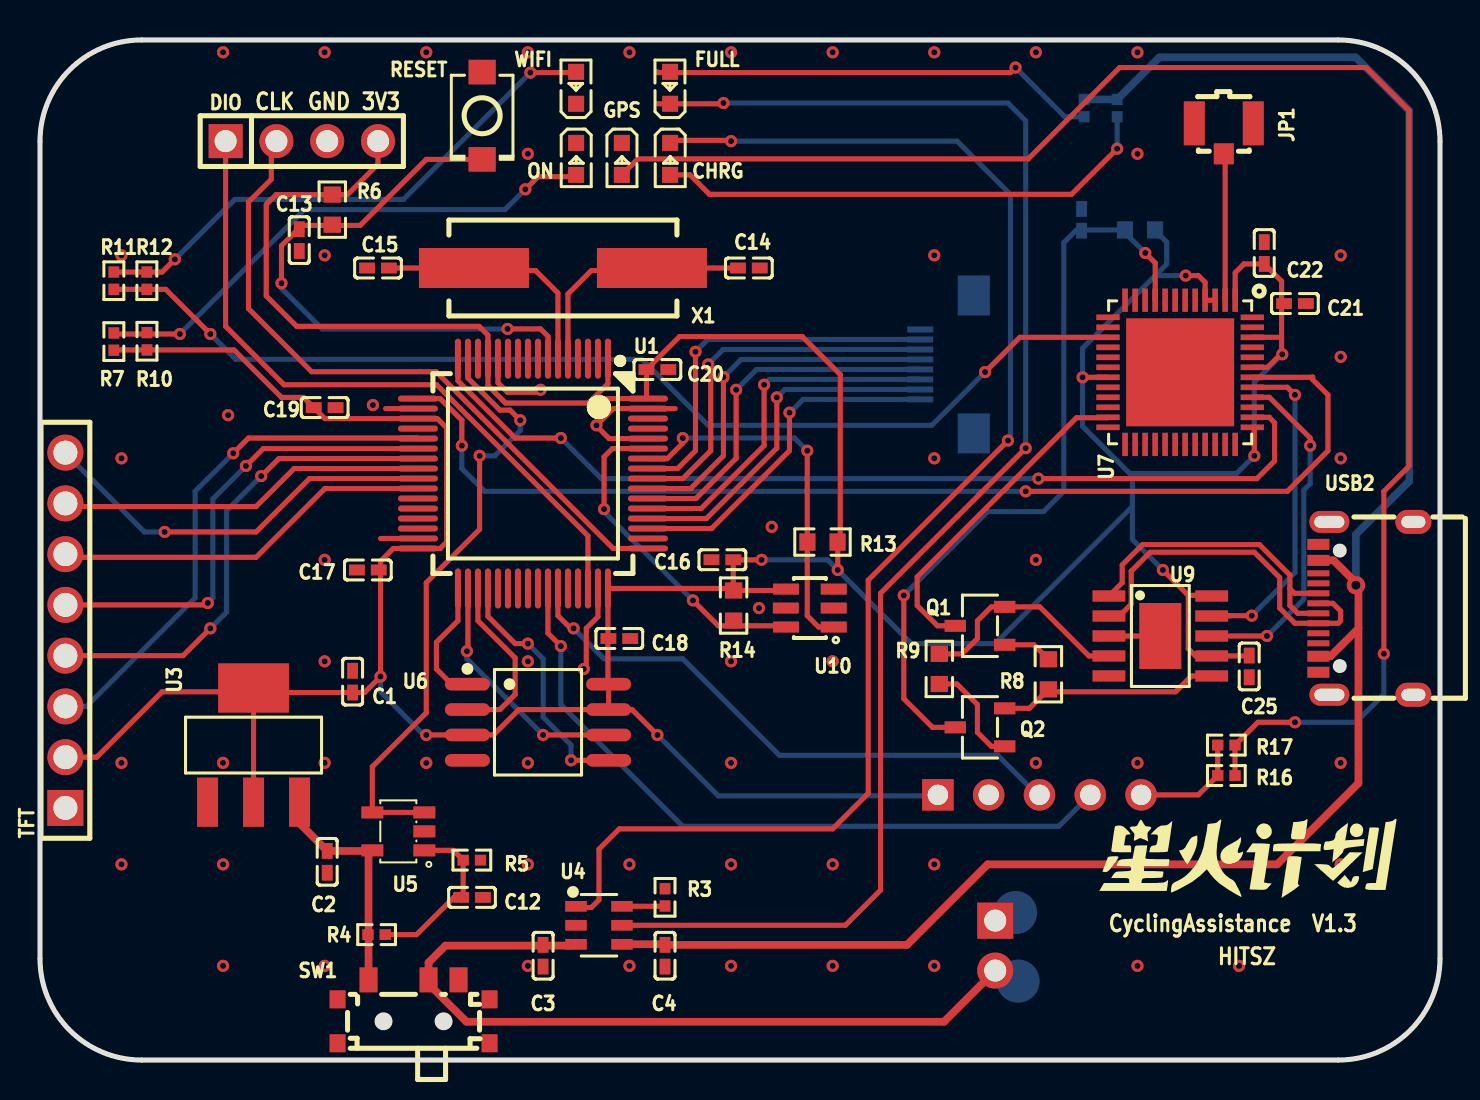
[diagram p2: board, top side]
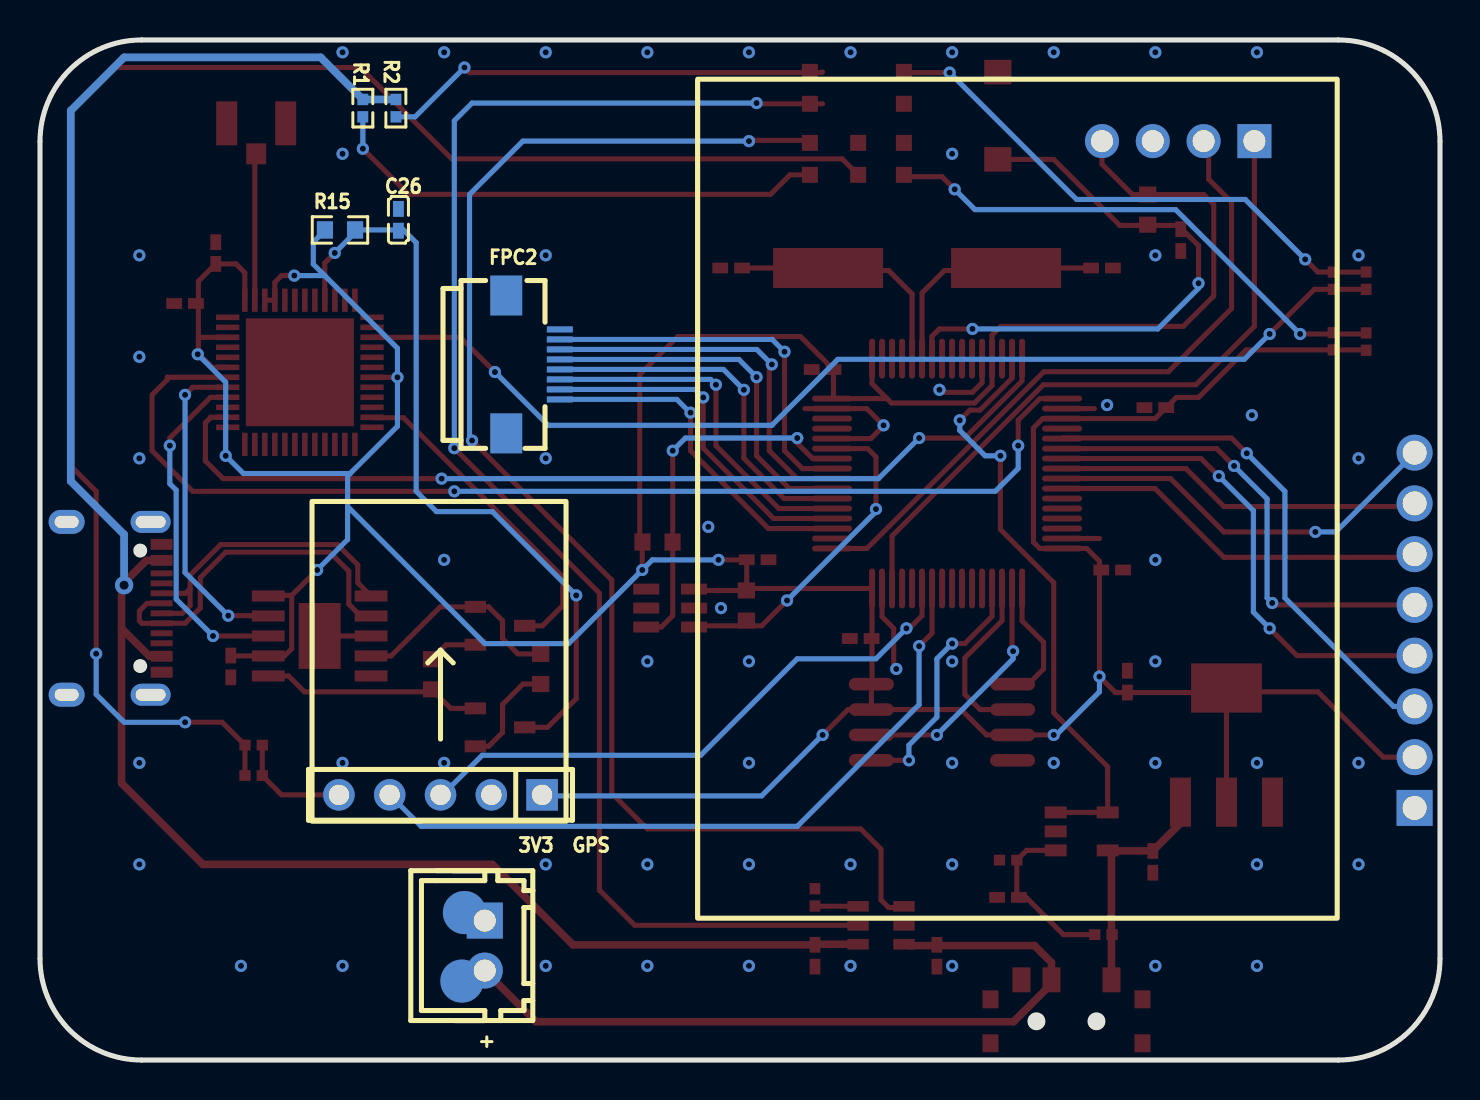
[diagram p3: board, bottom side, seen from below]

Outline 70 x 51.05 mm; copper layers: Top Layer, Bottom Layer. Coordinates in mm from the lower left corner of the outline.
Outline path: 0,45.97 arc(1.49,49.56) 5.08,51.05 64.92,51.05 arc(68.51,49.56) 70,45.97 70,5.08 arc(68.51,1.49) 64.92,0 5.08,0 arc(1.49,1.49) 0,5.08 0,45.97
Stack: Top Layer 0.035mm / Dielectric1 1.51mm FR4 er 4.5 / Bottom Layer 0.035mm

## Design rules (mm)
net OSC_OUT: DP1
net OSC_IN: DP1
template: JLCPCB Capability(Two Layers Board)
spacing copperThickness1oz (default): track to track 0.102, other pairs 0.152 to 0.3
spacing copperThickness2oz: track to track 0.203, other pairs 0.152 to 0.3
track width copperThickness1oz (default): min 0.127, default 0.254, max 2.54
track width copperThickness2oz: min 0.203, default 0.254, max 2.54
differential pair differentialPair (default): width min 0.127, default 0.254, max 2.54; gap min 0.152, default 0.152
via viaSize (default): diameter min 0.5, default 0.61, max 10; hole min 0.3, default 0.305, max 6.3

## Placement (name value [footprint] x y rotation side)
3V3  GPS  -  [HDR-TH_5P-P2.54-V-F]  49.97 13.27 0 bottom
+  ZX-XH2.54-2PZZ  [CONN-TH_2P-P2.50_HX25003-2A]  47.76 5.73 270 bottom
C1  2.2uF  [C0402]  15.63 18.94 90 top
C2  10uF  [C0402]  14.36 9.92 90 top
C3  10uF  [C0402]  25.16 5.22 90 top
C4  10uF  [C0402]  31.25 5.22 90 top
C12  100nF  [C0402]  21.6 8.14 0 top
C13  100nF  [C0402]  12.96 41.03 270 top
C14  20pF  [C0402]  35.44 39.64 180 top
C15  20pF  [C0402]  16.9 39.64 0 top
C16  100nF  [C0402]  34.12 25.04 180 top
C17  100nF  [C0402]  16.39 24.52 0 top
C18  100nF  [C0402]  28.97 21.09 180 top
C19  100nF  [C0402]  14.23 32.65 0 top
C20  100nF  [C0402]  30.87 34.56 0 top
C21  100nF  [C0402]  62.75 37.86 180 top
C22  10uF  [C0402]  61.21 40.39 270 top
C25  100nF  [C0402]  60.46 19.7 90 top
C26  100nF  [C0402]  52.08 42.05 270 bottom
CHRG  KT-0603R  [LED0603-RD]  31.5 45.1 270 top
DIO  -  [HDR-TH_4P-P2.54-V-M]  13.09 45.99 0 top
FPC2  AFC01-S08FCA-00  [FPC-SMD_P0.50-8P_FGS-XJ-H2.0]  45.35 34.81 90 bottom
FULL  KT-0603R  [LED0603-RD]  31.5 48.65 90 top
GPS  KT-0603R  [LED0603-RD]  29.09 45.1 270 top
JP1  U.FL-R-SMT-1(80)  [RF-SMD_FRF05002-JSS103M]  59.19 46.11 0 top
NOREF  -  [Pad_e725]  48.9 3.95 90 top
NOREF#2  -  [Pad_e724]  48.78 7.38 90 top
ON  KT-0603R  [LED0603-RD]  26.81 45.1 270 top
Q1  S8050  [SOT-23-3_L2.9-W1.6-P1.90-LS2.8-BR]  47 21.73 0 top
Q2  S8050  [SOT-23-3_L2.9-W1.6-P1.90-LS2.8-BR]  47 16.65 0 top
R1  180Ω  [R0402]  53.86 47.64 270 bottom
R2  180Ω  [R0402]  52.21 47.64 90 bottom
R3  2.7kΩ  [R0402]  31.25 8.14 90 top
R4  56kΩ  [R0402]  16.83 6.28 180 top
R5  56kΩ  [R0402]  21.59 10 180 top
R6  10kΩ  [R0603]  14.61 42.56 90 top
R7  180Ω  [R0402]  3.69 35.95 270 top
R8  10kΩ  [R0603]  50.42 19.3 270 top
R9  10kΩ  [R0603]  44.97 19.57 270 top
R10  180Ω  [R0402]  5.35 35.97 270 top
R11  180Ω  [R0402]  3.69 39 270 top
R12  180Ω  [r0402]  5.34 39 270 top
R13  10kΩ  [R0603]  39.12 25.92 180 top
R14  10kΩ  [R0603]  34.68 22.75 270 top
R15  10kΩ  [R0603]  55 41.54 180 bottom
R16  180Ω  [R0402]  59.32 14.24 180 top
R17  180Ω  [R0402]  59.32 15.76 180 top
RESET  TS-1088-AR02016  [SW-SMD_L3.9-W3.0-P4.45]  22.11 47.26 270 top
SW1  K3-1296S-E1  [SW-TH_K3-1296S-E1]  18.68 2.43 90 top
TFT  -  [HDR-TH_8P-P2.54-V-F-1]  1.27 21.51 90 top
U1  STM32F103RCT6  [LQFP-64_L10.0-W10.0-P0.50-LS12.0-BL]  24.65 29.35 180 top
U3  BL9110-330BPFB  [SOT-223_L6.5-W3.5-P2.30-LS7.0-BR]  10.68 15.76 270 top
U4  LGS4084HB6  [SOT-23-6_L2.9-W1.6-P0.95-LS2.8-BL]  27.95 6.74 270 top
U5  LMV321IDBVR  [SOT-23-5_L3.0-W1.7-P0.95-LS2.8-BR]  17.92 11.44 0 top
U6  W25Q32JVSSIQ  [SOIC-8_L5.3-W5.3-P1.27-LS8.0-BL]  24.9 16.9 270 top
U7  ESP32-PICO-D4  [ESP32-PICO-D4_lengthen]  57.01 34.42 270 top
U9  CH340K  [ESOP-10_L4.9-W3.9-P1.00-LS6.0-BL-EP]  56.02 21.22 270 top
U10  TLV493DA1B6HTSA2  [SOP-6_L3.0-W1.5-P0.95-LS2.5-BR]  38.49 22.62 0 top
USB2  TYPE-C 16PIN 2MD(073)  [USB-C-SMD_TYPE-C-6PIN-2MD-073]  66.29 22.61 90 top
WIFI  KT-0603R  [LED0603-RD]  26.81 48.65 90 top
X1  8MHz  [CRYSTAL-SMD_L11.5-W4.8-LS12.7]  26.15 39.64 180 top

## Footprints (pads in the part's own frame, mm; a bottom-side part is the same pattern mirrored in y, then rotated)
C0402
  rect 0.79x0.54 smd: 1(-0.545,0) 2(0.545,0)
CONN-TH_2P-P2.50_HX25003-2A
  rect 1.8x1.8 hole 1.1: 1(-1.25,0)
  round 1.8 hole 1.1: 2(1.25,0)
CRYSTAL-SMD_L11.5-W4.8-LS12.7
  rect 5.5x2 smd: 1(-4.45,0) 2(4.45,0)
ESOP-10_L4.9-W3.9-P1.00-LS6.0-BL-EP
  rect 0.56x1.64 smd: 1(-2,-2.57) 2(-1,-2.57) 3(0,-2.57) 4(1,-2.57) 5(2,-2.57) 6(2,2.57) 7(1,2.57) 8(0,2.57) 9(-1,2.57) 10(-2,2.57)
  rect 3.3x2.1 smd: 11(0,0)
ESP32-PICO-D4_lengthen
  rect 1.165x0.28 smd: 1(-3.608,2.752) 2(-3.608,2.252) 3(-3.608,1.752) 4(-3.608,1.251) 5(-3.608,0.75) 6(-3.608,0.25) 7(-3.608,-0.25) 8(-3.608,-0.75) 9(-3.608,-1.251) 10(-3.608,-1.752) 11(-3.608,-2.252) 12(-3.608,-2.752) 25(3.608,-2.752) 26(3.608,-2.252) 27(3.608,-1.752) 28(3.608,-1.251) 29(3.608,-0.75) 30(3.608,-0.25) 31(3.608,0.25) 32(3.608,0.75) 33(3.608,1.251) 34(3.608,1.752) 35(3.608,2.252) 36(3.608,2.752)
  rect 0.28x1.165 smd: 13(-2.752,-3.608) 14(-2.252,-3.608) 15(-1.752,-3.608) 16(-1.251,-3.608) 17(-0.75,-3.608) 18(-0.25,-3.608) 19(0.25,-3.608) 20(0.75,-3.608) 21(1.251,-3.608) 22(1.752,-3.608) 23(2.252,-3.608) 24(2.752,-3.608) 37(2.752,3.608) 38(2.252,3.608) 39(1.752,3.608) 40(1.251,3.608) 41(0.75,3.608) 42(0.25,3.608) 43(-0.25,3.608) 44(-0.75,3.608) 45(-1.251,3.608) 46(-1.752,3.608) 47(-2.252,3.608) 48(-2.752,3.608)
  rect 5.4x5.4 smd: 49(0,0)
FPC-SMD_P0.50-8P_FGS-XJ-H2.0
  rect 0.3x1.3 smd: 1(-1.75,-1.34) 2(-1.252,-1.339) 3(-0.75,-1.34) 4(-0.25,-1.34) 5(0.25,-1.34) 6(0.75,-1.34) 7(1.25,-1.34) 8(1.75,-1.34)
  rect 2x1.6 smd: 9(3.45,1.34) 10(-3.45,1.34)
HDR-TH_4P-P2.54-V-M
  rect 1.7x1.7 hole 1.1: 1(-3.81,0)
  round 1.7 hole 1.1: 2(-1.27,0) 3(1.27,0) 4(3.81,0)
HDR-TH_5P-P2.54-V-F
  rect 1.575x1.575 hole 1.02: 1(-5.08,0)
  round 1.575 hole 1.02: 2(-2.54,0) 3(0,0) 4(2.54,0) 5(5.08,0)
HDR-TH_8P-P2.54-V-F-1
  rect 1.8x1.8 hole 1.2: 1(-8.89,0)
  round 1.8 hole 1.2: 2(-6.35,0) 3(-3.81,0) 4(-1.27,0) 5(1.27,0) 6(3.81,0) 7(6.35,0) 8(8.89,0)
LED0603-RD
  rect 0.8x0.8 smd: 1(-0.799,0) 2(0.799,0)
LQFP-64_L10.0-W10.0-P0.50-LS12.0-BL
  oval 0.3x2 smd: 1(-3.75,-5.75) 2(-3.25,-5.75) 3(-2.75,-5.75) 4(-2.25,-5.75) 5(-1.75,-5.75) 6(-1.25,-5.75) 7(-0.75,-5.75) 8(-0.25,-5.75) 9(0.25,-5.75) 10(0.75,-5.75) 11(1.25,-5.75) 12(1.75,-5.75) 13(2.25,-5.75) 14(2.75,-5.75) 15(3.25,-5.75) 16(3.75,-5.75) 33(3.75,5.75) 34(3.25,5.75) 35(2.75,5.75) 36(2.25,5.75) 37(1.75,5.75) 38(1.25,5.75) 39(0.75,5.75) 40(0.25,5.75) 41(-0.25,5.75) 42(-0.75,5.75) 43(-1.25,5.75) 44(-1.75,5.75) 45(-2.25,5.75) 46(-2.75,5.75) 47(-3.25,5.75) 48(-3.75,5.75)
  oval 2x0.3 smd: 17(5.75,-3.75) 18(5.75,-3.25) 19(5.75,-2.75) 20(5.75,-2.25) 21(5.75,-1.75) 22(5.75,-1.25) 23(5.75,-0.75) 24(5.75,-0.25) 25(5.75,0.25) 26(5.75,0.75) 27(5.75,1.25) 28(5.75,1.75) 29(5.75,2.25) 30(5.75,2.75) 31(5.75,3.25) 32(5.75,3.75) 49(-5.75,3.75) 50(-5.75,3.25) 51(-5.75,2.75) 52(-5.75,2.25) 53(-5.75,1.75) 54(-5.75,1.25) 55(-5.75,0.75) 56(-5.75,0.25) 57(-5.75,-0.25) 58(-5.75,-0.75) 59(-5.75,-1.25) 60(-5.75,-1.75) 61(-5.75,-2.25) 62(-5.75,-2.75) 63(-5.75,-3.25) 64(-5.75,-3.75)
Pad_e724
  round 2.159 smd far side: 2(0,0)
Pad_e725
  round 2.159 smd far side: 2(0,0)
r0402
  rect 0.566x0.54 smd: 1(-0.433,0) 2(0.433,0)
R0402
  rect 0.566x0.54 smd: 1(-0.433,0) 2(0.433,0)
R0603
  rect 0.806x0.864 smd: 1(-0.753,0) 2(0.753,0)
RF-SMD_FRF05002-JSS103M
  rect 1x1.05 smd: 1(0,-0.762)
  rect 1.05x2.2 smd: 2(-1.475,0.762) 3(1.475,0.762)
SOIC-8_L5.3-W5.3-P1.27-LS8.0-BL
  oval 0.63x2.25 smd: 1(-1.905,-3.53) 2(-0.635,-3.53) 3(0.635,-3.53) 4(1.905,-3.53) 5(1.905,3.53) 6(0.635,3.53) 7(-0.635,3.53) 8(-1.905,3.53)
SOP-6_L3.0-W1.5-P0.95-LS2.5-BR
  rect 1.3x0.55 smd: 1(1.197,-0.95) 2(1.197,0) 3(1.197,0.95) 4(-1.19,0.95) 5(-1.197,0) 6(-1.19,-0.95)
SOT-23-3_L2.9-W1.6-P1.90-LS2.8-BR
  rect 1.07x0.6 smd: 1(1.235,-0.95) 2(1.235,0.95) 3(-1.235,0)
SOT-23-5_L3.0-W1.7-P0.95-LS2.8-BR
  rect 1.1x0.6 smd: 1(1.3,-0.95) 2(1.3,0) 3(1.3,0.95) 4(-1.3,0.95) 5(-1.3,-0.95)
SOT-23-6_L2.9-W1.6-P0.95-LS2.8-BL
  rect 0.532x1.072 smd: 1(-0.95,-1.149) 2(0,-1.149) 3(0.95,-1.149) 4(0.95,1.149) 5(0,1.149) 6(-0.95,1.149)
SOT-223_L6.5-W3.5-P2.30-LS7.0-BR
  rect 2.465x1.05 smd: 1(2.857,-2.3) 2(2.857,0) 3(2.857,2.3)
  rect 2.465x3.54 smd: 4(-2.857,0)
SW-SMD_L3.9-W3.0-P4.45
  rect 1.23x1.36 smd: 1(-2.185,0) 2(2.185,0)
SW-TH_K3-1296S-E1
  rect 1.25x0.9 smd: 1(1.587,-2.248) 2(1.587,-0.749) 3(1.587,2.252)
  rect 0.9x0.8 smd: 4(0.613,3.8) 5(-1.587,3.8) 6(-1.587,-3.8) 7(0.613,-3.8)
USB-C-SMD_TYPE-C-6PIN-2MD-073
  rect 0.55x1.1 smd: 1(-3.2,2.375) 2(-2.4,2.375) 11(2.4,2.375) 12(3.2,2.375)
  rect 0.3x1.1 smd: 3(-1.75,2.375) 4(-1.25,2.375) 5(-0.75,2.375) 6(-0.25,2.375) 7(0.25,2.375) 8(0.75,2.375) 9(1.25,2.375) 10(1.75,2.375)
  oval 1.1x2 hole 0.6x1.5: 13(-4.325,1.825) 14(4.325,1.825)
  oval 1.2x1.8 hole 0.6x1.2: 13(-4.325,-2.375) 14(4.325,-2.375)

## Nets
3V3: 3V3  GPS.1 C1.1 C16.1 C17.2 C18.2 C19.1 C20.1 C21.2 C22.2 C25.2 DIO.4 R6.2 R7.2 R10.2 R13.1 R14.1 R15.1 TFT.2 U1.1 U1.13 U1.19 U1.32 U1.48 U1.64 U3.2 U3.4 U6.3 U6.7 U6.8 U7.1 U7.3 U7.4 U7.19 U7.37 U7.43 U7.46 U9.7 U9.10 U10.4
GND: 3V3  GPS.2 +.1 C1.2 C2.1 C3.1 C4.1 C12.2 C13.2 C14.1 C15.1 C16.2 C17.1 C18.1 C19.2 C20.2 C21.1 C22.1 C25.1 C26.1 DIO.3 GPS.1 JP1.2 JP1.3 NOREF#2.2 ON.1 R3.2 R5.1 RESET.1 TFT.1 U1.12 U1.18 U1.31 U1.47 U1.60 U1.63 U3.1 U4.2 U5.2 U6.4 U7.49 U9.3 U9.11 U10.2 U10.3 U10.5 USB2.1 USB2.12 WIFI.1
BAT: +.2 C3.2 NOREF.2 SW1.2 U4.3
BAT_OUT: C2.2 R4.2 SW1.3 U3.3 U5.5
BAT_SEN: U1.15 U5.3 U5.4
COL0: FPC2.4 U1.54
COL1: FPC2.3 U1.53
COL2: FPC2.2 U1.52
COL3: FPC2.1 U1.51
DTR: Q1.2 R9.1 U9.4
ESP_EN: C26.2 Q2.3 R15.2 U7.9
ESP_IO0: Q1.3 U7.23
ESP_RX: U1.16 U7.38
ESP_TX: U1.17 U7.42
FLA_CLK: U1.34 U6.6
FLA_CS: U1.33 U6.1
FLA_DI: U1.36 U6.5
FLA_DO: U1.35 U6.2
GPS_RX: 3V3  GPS.4 U1.42
GPS_TX: 3V3  GPS.3 U1.43
MAG_SCL: R13.2 U1.58 U10.1
MAG_SDA: R14.2 U1.59 U10.6
NRST: C13.1 R6.1 RESET.2 U1.7
OSC_IN: C14.2 U1.5 X1.1
OSC_OUT: C15.2 U1.6 X1.2
PPS: 3V3  GPS.5 R16.2 R17.2
ROW0: FPC2.7 U1.57
ROW1: FPC2.6 U1.56
ROW2: FPC2.5 U1.55
RTS: Q2.2 R8.2 U9.6
SER_RX: U7.40 U9.8
SER_TX: U7.41 U9.9
SWDCLK: DIO.2 U1.49
SWDIO: DIO.1 U1.46
TFT_A0: TFT.6 U1.26
TFT_BL: TFT.8 U1.25
TFT_CS: TFT.7 U1.24
TFT_RES: TFT.5 U1.22
TFT_SCL: TFT.3 U1.21
TFT_SDA: TFT.4 U1.23
TYPE_5V: C4.2 R1.1 R2.2 U4.4 USB2.2 USB2.11
USB_D+: U9.1 USB2.6 USB2.8
USB_D-: U9.2 USB2.5 USB2.7
$1N1762: CHRG.2 R1.2
$1N1765: CHRG.1 U4.1
$1N1808: FULL.2 R2.1
$1N1886: R3.1 U4.6
$1N2004: FULL.1 U4.5
$1N2415: C12.1 R4.1 R5.2 U5.1
$1N24529: JP1.1 U7.2
$1N25826: ON.2 R7.1 R10.1
$1N25982: R11.1 R12.1 WIFI.2
$1N36211: R11.2 R12.2 U7.15
$1N38447: Q2.1 R9.2
$1N38448: Q1.1 R8.1
$1N40975: GPS.2 R16.1 R17.1

Pads without a net: FPC2 8 9 10; SW1 1 4 5 6 7; U1 2 3 4 8 9 10 11 14 20 27 28 29 30 37 38 39 40 41 44 45 50 61 62; U7 5 6 7 8 10 11 12 13 14 16 17 18 20 21 22 24 25 26 27 28 29 30 31 32 33 34 35 36 39 44 45 47 48; U9 5; USB2 3 4 9 10 13 14

## Via types
v1: diameter 0.61, hole 0.305, Top Layer to Bottom Layer, 120 vias
v2: diameter 0.914, hole 0.457, Top Layer to Bottom Layer, 1 via

## Routing (per net, layer and track width the routed paths; a pad name or vN(x,y) marks a point on that pad's centre or on a via; arc(x,y) is an arc through that point)
3V3: length 249.1
  Top Layer w0.254: 57.41,23.25 v1(56.14,24.52) ; 57.41,23.25 58.55,23.25 U9.10 ; 57.41,23.25 57.41,20.59 57.78,20.22 U9.7 60.44,20.22 C25.2 ; TFT.2 2.83,15.16 6.1,18.43 10.49,18.43 U3.4 ; v1(30.87,16.27) 29.6,17.54 U6.7 ; U7.1 59.76,39.4 60.2,39.84 C22.2 62.08,38.98 62.08,36.17 ; U7.43 61.38,34.67 62.08,35.37 62.08,36.17 ; DIO.4 16.9,44.84 15.38,43.31 R6.2 11.81,43.31 11.31,42.81 11.31,38.24 12.84,36.72 21.96,36.72 22.4,36.28 U1.13 22.4,33.76 23.28,32.88 27.43,32.88 27.65,33.1 ; v1(57.29,39.26) 57.92,39.26 58.26,38.92 U7.4 U7.3 ; 62.08,36.17 U7.46 ; v1(52.13,34.17) U7.19 ; 34.66,23.52 34.58,23.6 U1.48 28.4,18.84 U6.8 U6.7 ; 34.66,23.52 C16.1 34.67,25.03 v1(36.08,25.03) ; 34.66,23.52 R14.1 37.23,23.5 U10.4 ; U1.64 27.65,33.1 ; 27.65,33.1 28.4,33.85 U1.1 ; U6.7 23.94,17.54 22.67,16.27 U6.3 v1(19.31,16.27) ; v1(39.89,24.52) 39.89,25.91 R13.1 40.01,26.06 40.01,34.3 38.11,36.21 31.98,36.21 C20.1 30.32,33.18 30.3,33.16 ; v1(60.72,30.24) 60.72,31.56 U7.37 ; U3.4 10.9,18.39 C1.1 16.23,18.39 v1(17.03,19.19) 17.03,24.97 17.66,25.6 U1.32 20.01,25.6 20.33,25.92 20.33,31.64 19.87,32.1 U1.19 14.24,32.1 C19.1 13.18,33.16 12.07,33.16 9.7,35.54 R10.2 3.71,35.54 3.69,35.52 ; U3.4 U3.2
  Bottom Layer w0.254: 55.76,39.26 56.33,39.83 56.33,40.93 55.75,41.51 R15.1 ; 55.76,39.26 52.13,35.62 v1(52.13,34.17) 52.13,31.72 54.49,29.35 ; 55.76,39.26 v1(57.29,39.26) ; v1(36.08,25.03) 39.38,25.03 v1(39.89,24.52) 43.57,20.84 47.76,20.84 54.62,27.7 ; 54.62,27.7 54.62,29.22 54.49,29.35 ; 54.62,27.7 54.62,26.05 v1(56.14,24.52) ; 54.49,29.35 59.83,29.35 v1(60.72,30.24) 60.72,33.92 v1(62.11,35.32) ; v1(30.87,16.27) 33.92,13.22 44.84,13.22 3V3  GPS.1 ; v1(19.31,16.27) 19.19,16.27 17.03,18.43 v1(17.03,19.19)
GND: length 21.1
  Top Layer w0.254: v1(27.19,19.57) 27.31,19.7 27.31,21.6 27.9,22.19 U1.47 ; 31.76,32.6 U1.63 28.66,32.6 v1(27.82,31.76) 27.82,31.73 28.46,31.1 U1.60 ; v1(25.03,33.54) 24.9,33.41 23.38,33.41 22.9,33.89 U1.12 ; U1.31 17.03,26.1 ; U1.18 17.28,32.6 ; U9.11 U9.3
  vias: v1(4.07,40.27) v1(4.07,30.11) v1(4.07,14.87) v1(4.07,9.79) v1(9.15,50.43) v1(9.15,14.87) v1(9.15,9.79) v1(9.15,4.71) v1(9.41,32.27) v1(14.23,50.43) v1(14.23,40.27) v1(14.23,25.03) v1(14.23,19.95) v1(14.23,14.87) v1(14.23,4.71) v1(16.65,32.78) v1(19.31,50.43) v1(19.31,14.87) v1(24.39,50.43) v1(24.39,45.35) v1(24.39,19.95) v1(24.39,14.87) v1(24.39,9.79) v1(24.39,4.71) v1(29.47,50.43) v1(29.47,9.79) v1(29.47,4.71) v1(34.55,50.43) v1(34.55,19.95) v1(34.55,14.87) v1(34.55,9.79) v1(34.55,4.71) v1(35.95,22.62) v1(36.59,26.68) v1(39.63,50.43) v1(39.63,19.95) v1(39.63,9.79) v1(39.63,4.71) v1(44.71,50.43) v1(44.71,40.27) v1(44.71,30.11) v1(44.71,9.79) v1(44.71,4.71) v1(49.79,50.43) v1(49.79,25.03) v1(49.79,14.87) v1(54.87,50.43) v1(54.87,45.35) v1(54.87,14.87) v1(54.87,4.71) v1(59.95,4.71) v1(65.03,40.27) v1(65.03,35.19) v1(65.03,30.11) v1(65.03,14.87) v1(65.03,9.79)
BAT: length 38.7
  Top Layer w0.381: +.2 45.2,1.92 21.32,1.92 19.43,3.81 SW1.2 19.43,4.88 20.27,5.73 26.55,5.73
BAT_OUT: length 11.7
  Top Layer w0.381: 16.43,10.3 16.27,10.46 C2.2 12.98,11.85 U3.3 ; 16.43,10.3 SW1.3 ; 16.43,10.3 U5.5
BAT_SEN: length 30.2
  Top Layer w0.254: U1.15 21.4,34.12 23,32.52 23.5,32.52 v1(24.01,32.02) ; U5.3 U5.4 16.62,14.68 19.31,17.38 19.31,23.89 21.98,26.56 v1(21.98,30.24)
  Bottom Layer w0.254: v1(21.98,30.24) 22.74,30.24 24.01,31.51 v1(24.01,32.02)
COL0: length 18.3
  Top Layer w0.254: U1.54 32.79,28.1 34.81,30.11 v1(34.81,33.54)
  Bottom Layer w0.254: v1(34.81,33.54) 35.83,34.56 FPC2.4
COL1: length 18.1
  Top Layer w0.254: U1.53 33.06,27.6 36.2,30.75 v1(36.2,33.8)
  Bottom Layer w0.254: FPC2.3 36.47,34.06 v1(36.2,33.8)
COL2: length 17.8
  Top Layer w0.254: U1.52 33.32,27.1 36.84,30.62 v1(36.84,33.16)
  Bottom Layer w0.254: v1(36.84,33.16) 37.24,33.56 FPC2.2
COL3: length 17.4
  Top Layer w0.254: U1.51 33.58,26.6 37.47,30.49 v1(37.47,32.4)
  Bottom Layer w0.254: FPC2.1 38.16,33.06 37.5,32.4 v1(37.47,32.4)
DTR: length 11.2
  Top Layer w0.254: 44.71,20.32 46.1,20.32 46.87,21.09 46.87,21.98 47.57,22.68 Q1.2 49.99,22.68 52.44,20.22 U9.4
ESP_EN: length 38.3
  Top Layer w0.254: v1(43.19,23.25) 43.19,18.08 44.62,16.65 Q2.3 ; v1(55.26,40.39) 55.76,39.89 55.76,38.03 U7.9
  Bottom Layer w0.254: v1(43.19,23.25) 47.38,27.44 50.17,27.44 51.19,28.46 51.19,40.91 51.82,41.54 54.11,41.54 v1(55.26,40.39)
ESP_IO0: length 16.6
  Top Layer w0.254: U7.23 53.38,32.14 51.82,32.14 43.86,24.18 43.86,22.75 44.88,21.73 Q1.3
ESP_RX: length 47.5
  Top Layer w0.254: v1(26.04,31.13) 23.76,31.13 20.9,33.99 U1.16 ; v1(49.92,29.1) 60.84,29.1 61.73,29.98 61.73,31.89 61.48,32.14 61.48,32.17 U7.38
  Bottom Layer w0.254: v1(49.92,29.1) 28.08,29.1 v1(26.04,31.13)
ESP_TX: length 56.7
  Top Layer w0.254: v1(49.28,28.46) 62.37,28.46 64.4,30.49 64.4,33.29 63.64,34.05 63.64,34.18 63.63,34.17 U7.42 ; v1(21.09,30.75) 21.09,32.02 20.01,33.1 U1.17
  Bottom Layer w0.254: v1(21.09,30.75) 21.09,29.6 22.23,28.46 v1(49.28,28.46)
FLA_CLK: length 12.2
  Top Layer w0.254: U1.34 21.4,20.51 v1(21.34,20.46) ; v1(25.16,16.27) U6.6
  Bottom Layer w0.254: v1(21.34,20.46) 21.34,20.08 v1(25.16,16.27)
FLA_CS: length 6.3
  Top Layer w0.254: U6.1 20.58,18.81 19.82,19.57 19.82,20.91 20.9,21.98 U1.33
FLA_DI: length 12.6
  Top Layer w0.254: U1.36 22.4,22.2 23.76,20.84 v1(24.39,20.84) ; v1(26.55,15) U6.5
  Bottom Layer w0.254: v1(26.55,15) 26.55,15.76 25.16,17.16 25.16,20.08 v1(24.39,20.84)
FLA_DO: length 8.8
  Top Layer w0.254: U1.35 21.9,21.98 23.76,20.12 23.76,18.3 23,17.54 U6.2
GPS_RX: length 35.7
  Top Layer w0.254: U1.42 25.4,21.36 v1(26.04,20.71)
  Bottom Layer w0.254: v1(26.04,20.71) 26.04,17.79 32.13,11.7 50.94,11.7 3V3  GPS.4
GPS_TX: length 29.2
  Top Layer w0.254: U1.43 25.9,22.24 26.53,21.6 v1(26.68,21.6)
  Bottom Layer w0.254: v1(26.68,21.6) 28.2,20.08 32.14,20.08 36.97,15.25 47.89,15.25 49.87,13.27 3V3  GPS.3
MAG_SCL: length 18.6
  Top Layer w0.254: v1(38.36,30.49) 38.36,22.24 38.93,21.67 U10.1 ; U1.58 31.37,30.1 32.14,30.87 v1(32.14,31.13)
  Bottom Layer w0.254: v1(38.36,30.49) 37.73,31.13 v1(32.14,31.13)
MAG_SDA: length 16.6
  Top Layer w0.254: U10.6 37.24,21.73 33.92,21.73 v1(32.65,23) ; v1(28.2,27.57) 28.2,30.18 28.62,30.6 U1.59
  Bottom Layer w0.254: v1(28.2,27.57) 28.2,27.44 v1(32.65,23)
NRST: length 29.4
  Top Layer w0.254: U1.7 25.41,35.11 25.41,36.21 25.03,36.59 v1(23.38,36.59) ; RESET.2 19.31,45.07 16.01,41.77 13.09,41.77 12.07,40.75 v1(12.07,38.88)
  Bottom Layer w0.254: v1(12.07,38.88) 12.07,38.62 14.11,36.59 v1(23.38,36.59)
OSC_IN: length 12.3
  Top Layer w0.254: U1.5 26.4,38.34 27.57,39.51 30.47,39.51 X1.1 C14.2
OSC_OUT: length 12.3
  Top Layer w0.254: U1.6 25.9,38.39 24.77,39.51 21.82,39.51 X1.2 C15.2
PPS: length 5.8
  Top Layer w0.254: R17.2 R16.2 57.92,13.27 3V3  GPS.5
ROW0: length 19.2
  Top Layer w0.254: U1.57 31.88,29.6 32.78,30.49 v1(32.78,35.45)
  Bottom Layer w0.254: v1(32.78,35.45) 33.39,36.06 FPC2.7
ROW1: length 19
  Top Layer w0.254: U1.56 32.14,29.1 33.54,30.49 33.54,34.68 v1(33.41,34.81)
  Bottom Layer w0.254: FPC2.6 34.16,35.56 v1(33.41,34.81)
ROW2: length 18.6
  Top Layer w0.254: U1.55 32.53,28.6 34.17,30.24 v1(34.17,34.18)
  Bottom Layer w0.254: v1(34.17,34.18) 35.06,35.06 FPC2.5
RTS: length 11.1
  Top Layer w0.254: U9.6 57.57,19.22 56.78,18.43 50.54,18.43 R8.2 49.47,17.6 Q2.2
SER_RX: length 16.4
  Top Layer w0.254: U7.40 61.47,33.17 63.51,31.13 v1(63.51,30.75) ; v1(61.35,21.22) 59.47,21.22
  Bottom Layer w0.254: v1(63.51,30.75) 63.51,28.84 63.19,28.52 63.19,23.06 v1(61.35,21.22)
SER_TX: length 15.4
  Top Layer w0.254: 60.62,33.67 62.37,33.67 v1(62.75,33.29) ; v1(60.59,22.24) 59.49,22.24 59.47,22.22
  Bottom Layer w0.254: v1(62.75,33.29) 62.75,24.4 v1(60.59,22.24)
SWDCLK: length 33.9
  Top Layer w0.254: DIO.2 11.57,45.73 11.57,44.08 10.42,42.93 10.42,37.6 13.58,34.45 19.81,34.45 28.66,25.6 U1.49
SWDIO: length 34.4
  Top Layer w0.254: DIO.1 9.28,36.72 12.2,33.8 19.83,33.8 27.4,26.23 U1.46
TFT_A0: length 19.1
  Top Layer w0.254: TFT.6 1.43,25.16 10.8,25.16 14.24,28.6 U1.26
TFT_BL: length 20.4
  Top Layer w0.254: v1(6.23,26.43) 10.8,26.43 13.47,29.1 U1.25
  Bottom Layer w0.254: v1(6.23,26.43) 5.22,26.43 1.27,30.38 TFT.8
TFT_CS: length 18.5
  Top Layer w0.254: U1.24 12.7,29.6 10.8,27.7 1.43,27.7 1.27,27.86
TFT_RES: length 23.8
  Top Layer w0.254: v1(10.3,29.73) 11.16,30.6 U1.22 ; 1.27,22.78 8.3,22.78 v1(8.39,22.87)
  Bottom Layer w0.254: v1(8.39,22.87) 8.64,23.13 8.64,28.08 v1(10.3,29.73)
TFT_SCL: length 26.3
  Top Layer w0.254: U1.21 18.87,31.13 10.42,31.13 v1(9.66,30.37)
  Bottom Layer w0.254: 1.27,17.7 2.33,17.7 7.76,23.13 7.76,28.46 v1(9.66,30.37)
TFT_SDA: length 24.7
  Top Layer w0.254: v1(11.06,29.22) 11.07,29.22 11.95,30.1 U1.23 ; TFT.4 7.15,20.24 v1(8.52,21.6)
  Bottom Layer w0.254: v1(8.52,21.6) 9.33,22.42 9.33,27.5 v1(11.06,29.22)
TYPE_5V: length 98.3
  Top Layer w0.381: 65.92,21.6 65.92,23.76 64.68,25.01 USB2.11 ; 65.92,21.6 65.92,13.86 61.86,9.79 47.38,9.79 43.35,5.77 C4.2 31.22,5.79 U4.4 ; 65.92,21.6 64.53,20.21 USB2.2
  Bottom Layer w0.381: R2.2 R1.1 55.96,50.18 65.79,50.18 68.46,47.51 68.46,28.97 65.79,26.3 v2(65.79,23.76)
USB_D+: length 15.9
  Top Layer w0.254: 62.49,23.58 62.49,24.27 60.97,25.79 55.13,25.79 54.11,24.78 54.11,23.89 U9.1 ; 62.49,23.58 62.49,22.75 62.88,22.36 USB2.6 ; 62.49,23.58 62.72,23.36 USB2.8
USB_D-: length 18.1
  Top Layer w0.254: USB2.5 64.91,21.86 65.03,21.98 65.03,22.47 64.65,22.86 USB2.7 ; U9.2 53.97,22.22 54.56,22.81 54.56,24.47 55.51,25.41 60.72,25.41 61.98,24.14 61.98,22.62 62.75,21.86 63.92,21.86
$1N1762: length 25.3
  Top Layer w0.254: v1(53.86,45.61) 51.58,43.32 33.47,43.32 32.5,44.3 CHRG.2
  Bottom Layer w0.254: v1(53.86,45.61) 53.86,47.2
$1N1765: length 69.7
  Top Layer w0.254: v1(48.4,31) 41.41,24.02 41.41,13.35 39.63,11.57 28.97,11.57 27.95,10.55 27.95,8.01 27.57,7.63 26.86,7.63 U4.1 ; CHRG.1 31.5,46.02 34.52,46.02 v1(34.55,45.99)
  Bottom Layer w0.254: v1(34.55,45.99) 45.86,45.99 48.52,43.32 48.52,31.13 v1(48.4,31)
$1N1808: length 22.5
  Top Layer w0.254: 30.87,49.45 30.91,49.42 48.52,49.42 v1(48.78,49.67)
  Bottom Layer w0.254: 52.21,47.2 51.24,47.2 v1(48.78,49.67)
$1N1886: length 2.2
  Top Layer w0.254: R3.1 31.24,7.69 U4.6
$1N2004: length 74
  Top Layer w0.254: v1(49.28,30.62) 42.03,23.36 42.03,8.5 40.27,6.74 U4.5 ; v1(34.17,47.89) 34.13,47.85 FULL.1 30.87,47.85
  Bottom Layer w0.254: v1(34.17,47.89) 48.4,47.89 49.28,47 v1(49.28,30.62)
$1N2415: length 8.6
  Top Layer w0.254: R4.1 18.83,6.28 20.69,8.14 C12.1 21.16,8.25 R5.2 20.67,10.49 U5.1
$1N24529: length 7.4
  Top Layer w0.254: U7.2 59.26,45.28 JP1.1
$1N25826: length 26.4
  Top Layer w0.254: v1(24.27,43.57) 24.9,44.21 26.72,44.21 ON.2 ; v1(6.99,36.33) 3.74,36.33 R7.1
  Bottom Layer w0.254: v1(6.99,36.33) 13.22,42.56 23.25,42.56 v1(24.27,43.57)
$1N25982: length 27.3
  Top Layer w0.254: v1(24.52,49.42) 26.77,49.42 WIFI.2 ; v1(6.74,40.07) 6.1,39.44 R12.1 R11.1
  Bottom Layer w0.254: v1(24.52,49.42) 18.17,43.07 9.74,43.07 v1(6.74,40.07)
$1N36211: length 54.4
  Top Layer w0.254: v1(47.25,34.43) 48.99,36.17 U7.15 ; v1(8.52,36.33) 6.28,38.57 3.69,38.57
  Bottom Layer w0.254: v1(8.52,36.33) 9.79,35.06 30.11,35.06 33.41,31.76 44.59,31.76 v1(47.25,34.43)
$1N38447: length 5.6
  Top Layer w0.254: Q2.1 47.57,15.7 46.87,16.4 46.87,17.79 45.85,18.82 44.71,18.82
$1N38448: length 2.5
  Top Layer w0.254: R8.1 49.7,20.78 Q1.1
$1N40975: length 82.2
  Top Layer w0.254: v1(62.75,16.9) 60.89,16.9 R17.1 R16.1 ; GPS.2 29.89,45.1 49.41,45.1 53.98,49.67 66.3,49.67 68.46,47.51 68.46,29.73 67.19,28.46 v1(67.19,20.33)
  Bottom Layer w0.254: v1(67.19,20.33) 67.19,18.3 65.79,16.9 v1(62.75,16.9)

## Copper pours and planes (outline as drawn; the poured copper is in the pictures)
GND on Top Layer: -2.91,52.34 71.76,52.34 71.76,-2.4 -2.91,-2.4
GND on Bottom Layer: -1.01,54.24 72.02,54.24 72.02,-5.45 -1.01,-5.45

## Text on the board
Top Silkscreen Layer: CLK | GND | 3V3 | CyclingAssistance  V1.3 | HITSZ

# Board PCB5
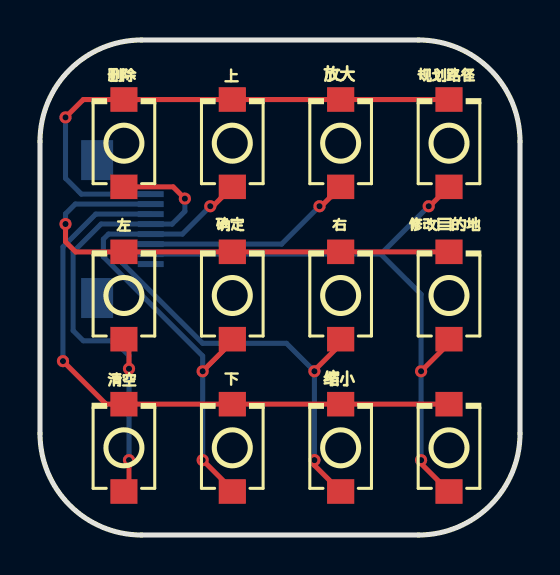
[diagram p4: board, top side]
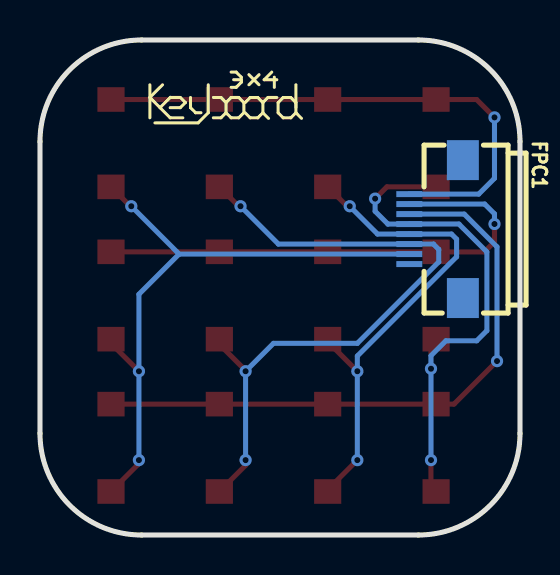
[diagram p5: board, bottom side, seen from below]

Outline 24 x 24.77 mm; copper layers: Top Layer, Bottom Layer. Coordinates in mm from the lower left corner of the outline.
Outline path: 0,19.69 arc(1.49,23.28) 5.08,24.77 18.92,24.77 arc(22.52,23.28) 24,19.69 24,5.08 arc(22.52,1.49) 18.92,0 5.08,0 arc(1.49,1.49) 0,5.08 0,19.69
Stack: Top Layer 0.035mm / Dielectric1 1.51mm FR4 er 4.5 / Bottom Layer 0.035mm

## Design rules (mm)
template: JLCPCB Capability(Two Layers Board)
spacing copperThickness1oz (default): track to track 0.102, other pairs 0.152 to 0.3
spacing copperThickness2oz: track to track 0.203, other pairs 0.152 to 0.3
track width copperThickness1oz (default): min 0.127, default 0.254, max 2.54
track width copperThickness2oz: min 0.203, default 0.254, max 2.54
differential pair differentialPair (default): width min 0.127, default 0.254, max 2.54; gap min 0.152, default 0.152
via viaSize (default): diameter min 0.5, default 0.61, max 10; hole min 0.3, default 0.305, max 6.3

## Placement (name value [footprint] x y rotation side)
FPC1  AFC01-S08FCA-00  [FPC-SMD_P0.50-8P_FGS-XJ-H2.0]  4.2 15.3 270 bottom
SW5  TS-1088-AR02016  [SW-SMD_L3.9-W3.0-P4.45]  15.03 19.6 90 top
SW13  TS-1088-AR02016  [SW-SMD_L3.9-W3.0-P4.45]  15.03 4.36 90 top
SW14  TS-1088-AR02016  [SW-SMD_L3.9-W3.0-P4.45]  20.45 4.36 90 top
上  TS-1088-AR02016  [SW-SMD_L3.9-W3.0-P4.45]  9.62 19.6 90 top
下  TS-1088-AR02016  [SW-SMD_L3.9-W3.0-P4.45]  9.62 4.36 90 top
修改目的地  TS-1088-AR02016  [SW-SMD_L3.9-W3.0-P4.45]  20.45 11.98 90 top
删除  TS-1088-AR02016  [SW-SMD_L3.9-W3.0-P4.45]  4.2 19.6 90 top
右  TS-1088-AR02016  [SW-SMD_L3.9-W3.0-P4.45]  15.03 11.98 90 top
左  TS-1088-AR02016  [SW-SMD_L3.9-W3.0-P4.45]  4.2 11.98 90 top
清空  TS-1088-AR02016  [SW-SMD_L3.9-W3.0-P4.45]  4.2 4.36 90 top
确定  TS-1088-AR02016  [SW-SMD_L3.9-W3.0-P4.45]  9.62 11.98 90 top
规划路径  TS-1088-AR02016  [SW-SMD_L3.9-W3.0-P4.45]  20.45 19.6 90 top

## Footprints (pads in the part's own frame, mm; a bottom-side part is the same pattern mirrored in y, then rotated)
FPC-SMD_P0.50-8P_FGS-XJ-H2.0
  rect 0.3x1.3 smd: 1(-1.75,-1.34) 2(-1.252,-1.339) 3(-0.75,-1.34) 4(-0.25,-1.34) 5(0.25,-1.34) 6(0.75,-1.34) 7(1.25,-1.34) 8(1.75,-1.34)
  rect 2x1.6 smd: 9(3.45,1.34) 10(-3.45,1.34)
SW-SMD_L3.9-W3.0-P4.45
  rect 1.23x1.36 smd: 1(-2.185,0) 2(2.185,0)

## Nets
COL0_: FPC1.4 删除.1 左.1 清空.1
COL1_: FPC1.5 上.1 下.1 确定.1
COL2_: FPC1.6 SW5.1 SW13.1 右.1
COL3_: FPC1.7 SW14.1 修改目的地.1 规划路径.1
ROW0_: FPC1.1 SW5.2 上.2 删除.2 规划路径.2
ROW1_: FPC1.2 修改目的地.2 右.2 左.2 确定.2
ROW2_: FPC1.3 SW13.2 SW14.2 下.2 清空.2

Pads without a net: FPC1 8 9 10

## Via types
v1: diameter 0.61, hole 0.305, Top Layer to Bottom Layer, 15 vias

## Routing (per net, layer and track width the routed paths; a pad name or vN(x,y) marks a point on that pad's centre or on a via; arc(x,y) is an arc through that point)
COL0_: length 26.1
  Top Layer w0.254: 左.1 4.45,9.54 v1(4.45,8.32) ; 删除.1 6.66,17.42 v1(7.24,16.83) ; 清空.1 4.45,2.43 v1(4.45,3.75)
  Bottom Layer w0.254: v1(7.24,16.83) 7.24,16.19 6.61,15.55 FPC1.4 5.53,15.56 3.05,15.56 1.66,14.16 1.66,10.22 2.16,9.72 3.71,9.72 4.45,8.97 v1(4.45,8.32) v1(4.45,3.75)
COL1_: length 25
  Top Layer w0.254: v1(8.51,16.45) 8.65,16.45 上.1 ; v1(8.13,3.75) 9.62,2.27 下.1 ; 确定.1 9.62,9.67 v1(8.13,8.19)
  Bottom Layer w0.254: v1(8.51,16.45) 7.12,15.05 FPC1.5 3.42,15.05 3.17,14.8 3.17,13.92 8.13,8.95 v1(8.13,8.19) v1(8.13,3.75)
COL2_: length 33.5
  Top Layer w0.254: v1(13.72,8.19) 13.72,8.23 15.03,9.54 右.1 ; SW13.1 13.72,3.49 v1(13.72,3.75) ; v1(13.98,16.45) 14.06,16.45 SW5.1
  Bottom Layer w0.254: v1(13.72,3.75) v1(13.72,8.19) 12.32,9.59 8.13,9.59 4.06,13.66 4.06,14.29 4.33,14.55 FPC1.6 12.08,14.55 v1(13.98,16.45)
COL3_: length 31.8
  Top Layer w0.254: v1(19.44,16.45) 19.48,16.45 规划路径.1 ; 修改目的地.1 20.45,9.59 v1(19.06,8.19) ; SW14.1 19.06,3.57 v1(19.06,3.75)
  Bottom Layer w0.254: 17.04,14.05 FPC1.7 ; 17.04,14.05 v1(19.44,16.45) ; 17.04,14.05 19.06,12.04 v1(19.06,8.19) v1(19.06,3.75)
ROW0_: length 27.2
  Top Layer w0.254: v1(1.28,20.89) 2.17,21.79 删除.2 上.2 SW5.2 规划路径.2
  Bottom Layer w0.254: v1(1.28,20.89) 1.28,17.84 2.07,17.05 FPC1.1
ROW1_: length 25.2
  Top Layer w0.254: 修改目的地.2 右.2 确定.2 左.2 4.19,14.16 1.78,14.16 1.28,14.67 v1(1.28,15.56)
  Bottom Layer w0.254: v1(1.28,15.56) 1.28,16.07 1.77,16.56 FPC1.2
ROW2_: length 31
  Top Layer w0.254: SW14.2 SW13.2 下.2 清空.2 3.3,6.55 v1(1.15,8.7)
  Bottom Layer w0.254: FPC1.3 2.79,16.05 1.15,14.42 v1(1.15,8.7)

## Text on the board
Top Silkscreen Layer: 缩小 | 放大
